# Altium project PA_CONTROL_BOARD.PrjPcb
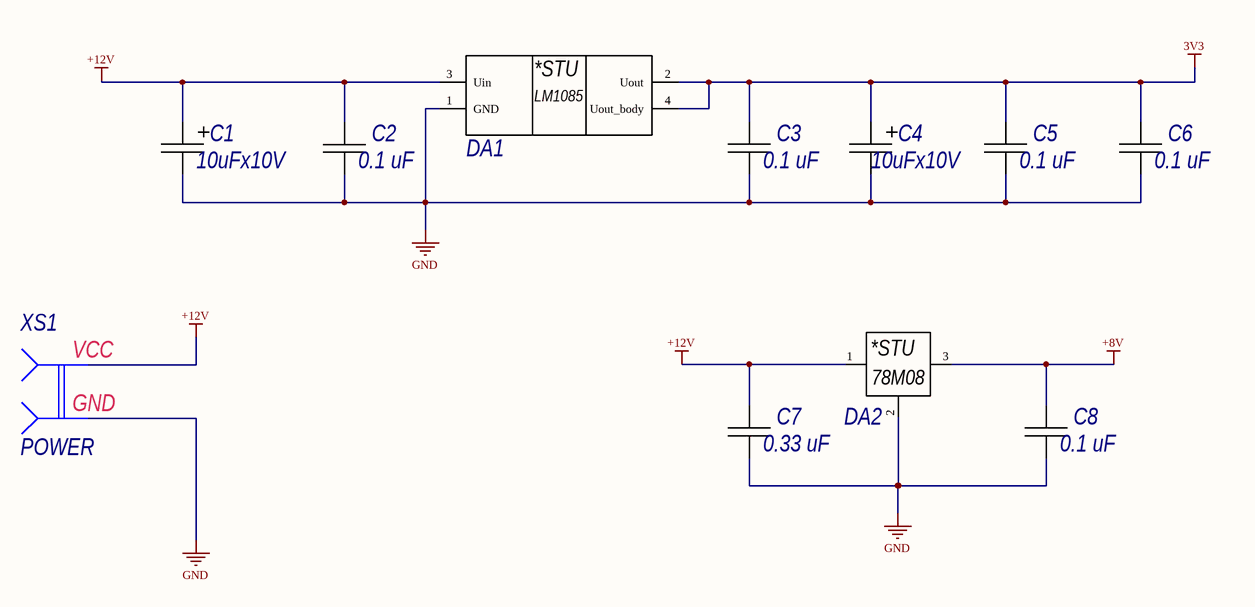
[diagram p0: POWER_SUPPLY.SchDoc]
12 sheets, 201 parts. Net scope: flat (ports and power ports of the same name join across sheets).
Board file: PA_CONTROL_BOARD.PcbDoc
Sheets:
  POWER_SUPPLY.SchDoc
  CAN.SchDoc
  FLASH.SchDoc
  DS18B20.SchDoc
  DIRECTIONAL_COUPLER.SchDoc
  FAN_CTRL.SchDoc
  JTAG_MCU.SchDoc
  SEQUENCER.SchDoc
  ETH_PHY.SchDoc
  MCU_CORE.SchDoc
  IIC_LCD.SchDoc
  EEPROM.SchDoc

## Sheet POWER_SUPPLY.SchDoc
size A4; SheetNumber: 1; SheetTotal: 3

### Parts
C1  10uFx10V
C2  0.1 uF  [C0805C]
C3  0.1 uF  [C0805C]
C4  10uFx10V
C5  0.1 uF  [C0805C]
C6  0.1 uF  [C0805C]
C7  0.33 uF  [C0805C]
C8  0.1 uF  [C0805C]
DA1  LM1085ISX-3.3  [LM1085ISX-3.3]  (value not drawn)
DA2  78M08CDT  [SC_TO-252AA]  (value not drawn)
XS1  POWER  [DG25C-B-02P-13]

### Nets
3V3: C3.2 C4.1 C5.2 C6.2 DA1.2(Uout) DA1.4(Uout_body)
+8V: C8.2 DA2.3(Out)
+12V: C1.1 C2.2 DA1.3(Uin) DA2.1(In) XS1.2
GND: C1.2 C2.1 C3.1 C4.2 C5.1 C6.1 C7.1 C8.1 DA1.1(GND) DA2.2(GND) XS1.1

Not connected (* = marked no-connect by the designer): C7 2

### Notes on the sheet
- (in symbol 78M08CDT) *STU; 78M08
- (in symbol CONNECT_PW) VCC; GND
- (in symbol LM1085ISX-3.3) *STU; LM1085

### Library data of the parts
C1 C4 = CAP_TECAP_A: Type: Конденсатор; Published: 20.08.2010; Publisher: Andrew Danich
C2 C3 C5-C8 = CAP_0805: Type: Конденсатор; Published: 18.05.2010; Publisher: Andrew Danich
XS1 = CONNECT_PW: Value: Connector; Published: 07.03.2013; Publisher: Andrew Danich; Type: Розетка
DA1 = LM1085ISX-3.3: Published: 31.07.2015; Publisher: Andrew Danich; Type: Микросхема
DA2 = 78M08CDT: Published: 13.08.2015; Publisher: Andrew Danich; Type: Микросхема

## Sheet CAN.SchDoc
size A4
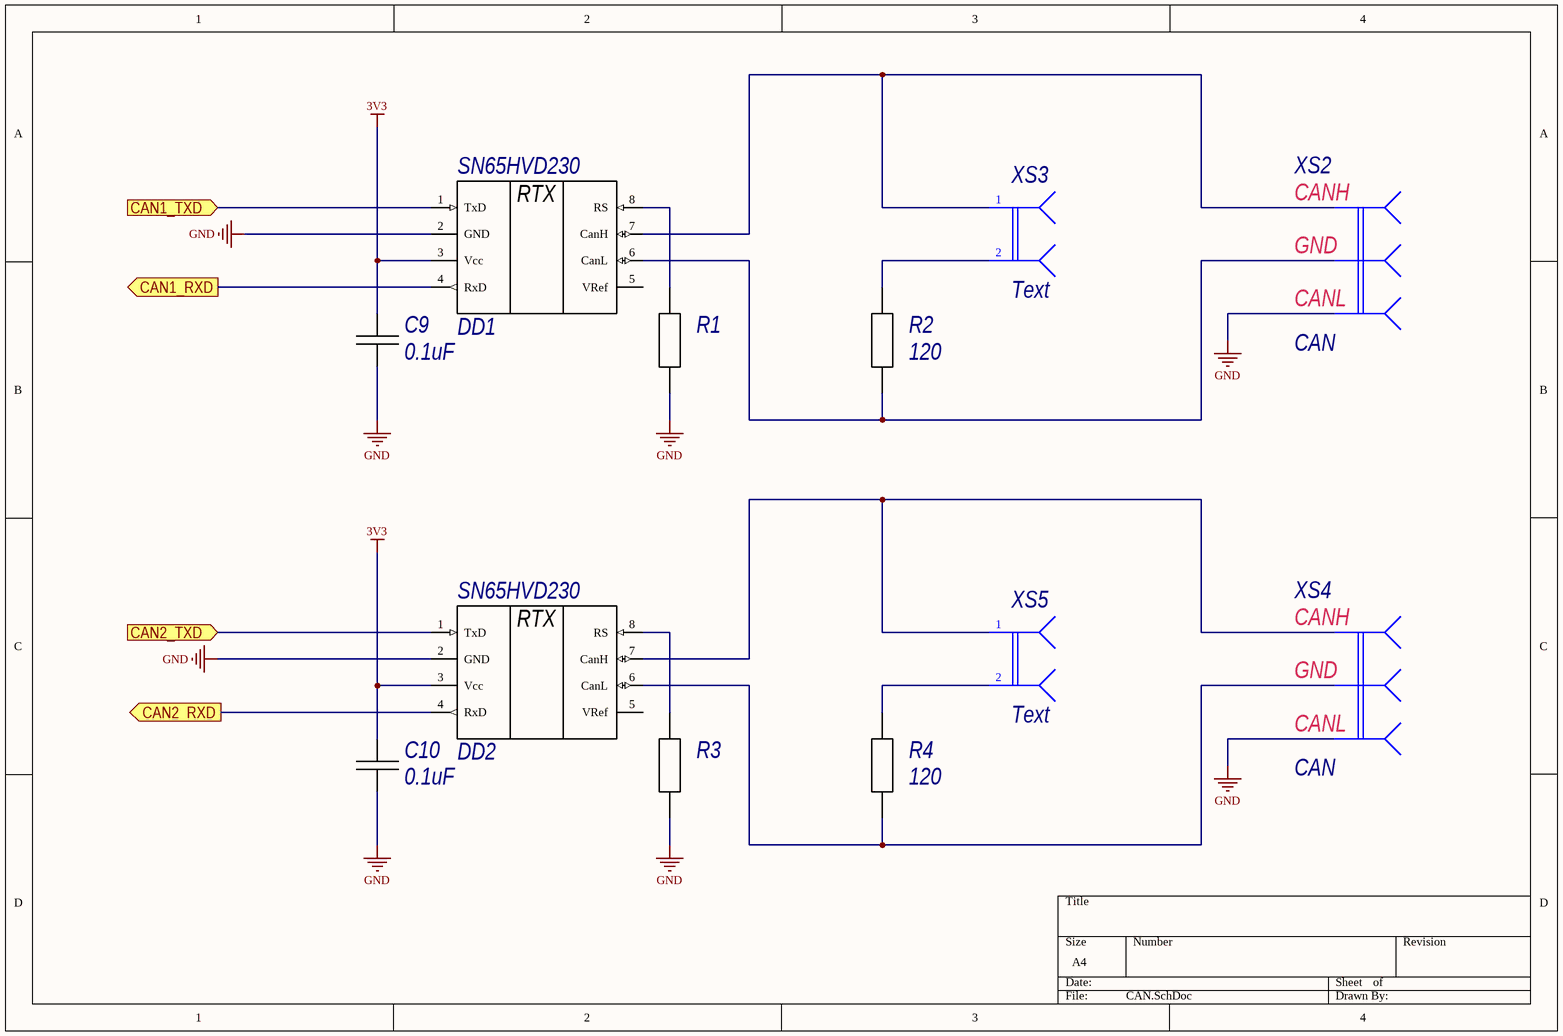
[diagram p1: CAN.SchDoc]

### Parts
(Parts that share a designator on the sheet are numbered #1, #2 ... from top to bottom, then left to right.)
C9  0.1uF  [C0805C]
C10#1  0.1uF  [C0805C]
DD1  SN65HVD230  [SOIC8 (SO-8)]
DD2#1  SN65HVD230  [SOIC8 (SO-8)]
R1  R0805  [C0805R]  (value not drawn)
R2  120  [C0805R]
R3#1  R0805  [C0805R]  (value not drawn)
R4#1  120  [C0805R]
XS2  CAN  [YX-XH-3]
XS3  Text  [PLD2]
XS4  CAN  [YX-XH-3]
XS5  Text  [PLD2]

### Ports
CAN1_RXD (out), CAN1_TXD (in), CAN2_RXD (out), CAN2_TXD (in)

### Nets
3V3: C9.2 C10#1.2 DD1.3(Vcc) DD2#1.3(Vcc)
GND: C9.1 C10#1.1 DD1.2(GND) DD2#1.2(GND) R1.2 R3#1.2 XS2.3 XS4.3
CAN1_RXD: DD1.4(RxD) ; port CAN1_RXD
CAN1_TXD: DD1.1(TxD) ; port CAN1_TXD
NetDD1_6: DD1.6(CanL) R2.2 XS2.2
NetDD1_7: DD1.7(CanH) XS2.1 XS3.1
NetDD1_8: DD1.8(RS) R1.1
NetDD2#1_1: DD2#1.1(TxD) ; port CAN2_TXD
NetDD2#1_4: DD2#1.4(RxD) ; port CAN2_RXD
NetDD2#1_6: DD2#1.6(CanL) R4#1.2 XS4.2
NetDD2#1_7: DD2#1.7(CanH) XS4.1 XS5.1
NetDD2#1_8: DD2#1.8(RS) R3#1.1
NetR2_1: R2.1 XS3.2
NetR4#1_1: R4#1.1 XS5.2

Not connected (* = marked no-connect by the designer): DD1 5(VRef); DD2#1 5(VRef)

### Notes on the sheet
- (in symbol CONNECT_CAN) CANH; GND; CANL
- (in symbol SN65HVD230) RTX

### Library data of the parts
C9 C10#1 = CAP_0805: Type: Конденсатор; Published: 18.05.2010; Publisher: Andrew Danich
DD1 DD2#1 = SN65HVD230: Высокоскоростной CAN-Трансивер, 1Мб/с, 12В/24В, до 112 узлов; Published: 26.02.2013; Publisher: Andrew Danich; Type: Микросхема
R2 R4#1 = R0805: Published: 24.03.2010; Publisher: Andrew Danich; Type: Резистор
XS2 XS4 = CONNECT_CAN: Published: 07.03.2013; Publisher: Andrew Danich; Type: Розетка
XS3 XS5 = DS1021: Value: Connector; Published: 07.03.2013; Publisher: Andrew Danich; Type: Розетка
R1 R3#1 = R0805: Published: 24.03.2010; Publisher: Andrew Danich; Type: Резистор

## Sheet FLASH.SchDoc
size A4
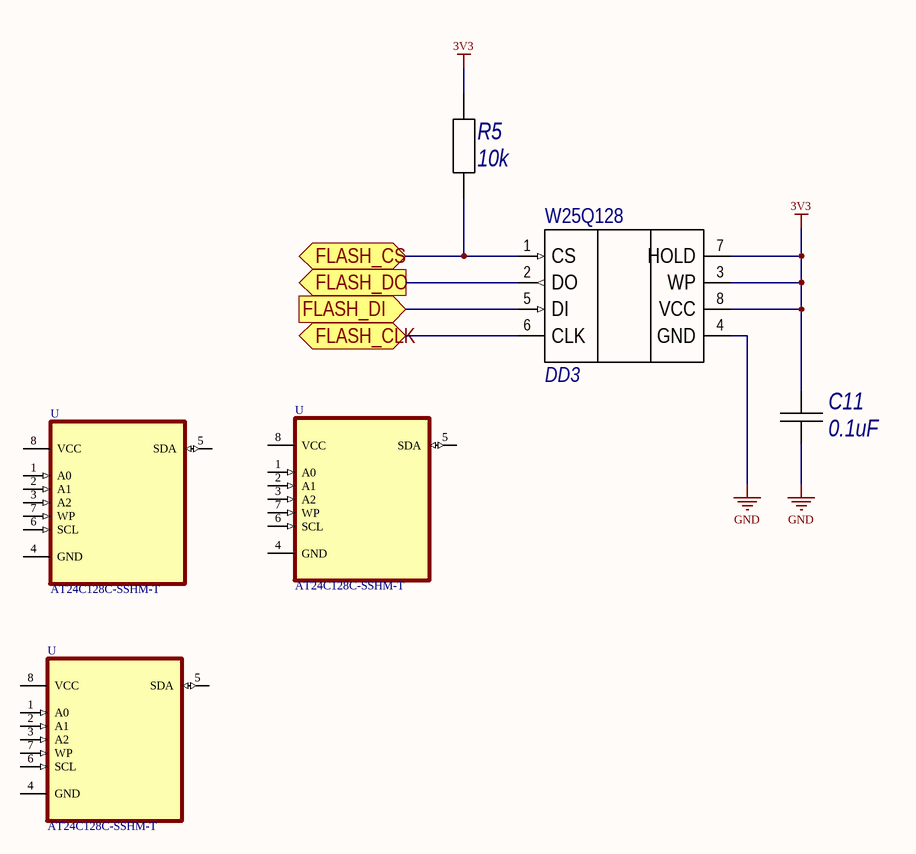
[diagram p2: FLASH.SchDoc]

### Parts
(Parts that share a designator on the sheet are numbered #1, #2 ... from top to bottom, then left to right.)
C11  0.1uF  [C0805C]
DD3  W25Q128  [SOIC8 (SO-8)]
R5  10k  [C0805R]
U#1  AT24C128C-SSHM-T  [SOIC127P600X175-8N]
U#2  AT24C128C-SSHM-T  [SOIC127P600X175-8N]
U#3  AT24C128C-SSHM-T  [SOIC127P600X175-8N]

### Ports
FLASH_CLK (bidir), FLASH_CS (bidir), FLASH_DI (in), FLASH_DO (out)

### Nets
3V3: C11.2 DD3.3(WP) DD3.7(HOLD) DD3.8(VCC) R5.2
GND: C11.1 DD3.4(GND)
NetDD3_1: DD3.1(CS) R5.1 ; port FLASH_CS
NetDD3_2: DD3.2(DO) ; port FLASH_DO
NetDD3_5: DD3.5(DI) ; port FLASH_DI
NetDD3_6: DD3.6(CLK) ; port FLASH_CLK

Not connected (* = marked no-connect by the designer): U#1 1(A0) 2(A1) 3(A2) 4(GND) 5(SDA) 6(SCL) 7(WP) 8(VCC); U#2 1(A0) 2(A1) 3(A2) 4(GND) 5(SDA) 6(SCL) 7(WP) 8(VCC); U#3 1(A0) 2(A1) 3(A2) 4(GND) 5(SDA) 6(SCL) 7(WP) 8(VCC)

### Library data of the parts
C11 = CAP_0805: Type: Конденсатор; Published: 18.05.2010; Publisher: Andrew Danich
R5 = RES_0805: Published: 24.03.2010; Publisher: Andrew Danich; Type: Резистор
U#1-U#3 = AT24C128C-SSHM-T: EEPROM Memory IC 128Kb _16K x 8_ IÂ²C 1MHz 550ns 8-SOIC; MF: Microchip; MP: AT24C128C-SSHM-T; SnapEDA_Link: https://www.snapeda.com/parts/AT24C128C-SSHM-T/Microchip/view-part/1771999/?ref=snap; Value: *; Package: SO-8 Microchip; Price: None; Availability: Unavailable
DD3 = W25Q128: Value: *

## Sheet DS18B20.SchDoc
size A4
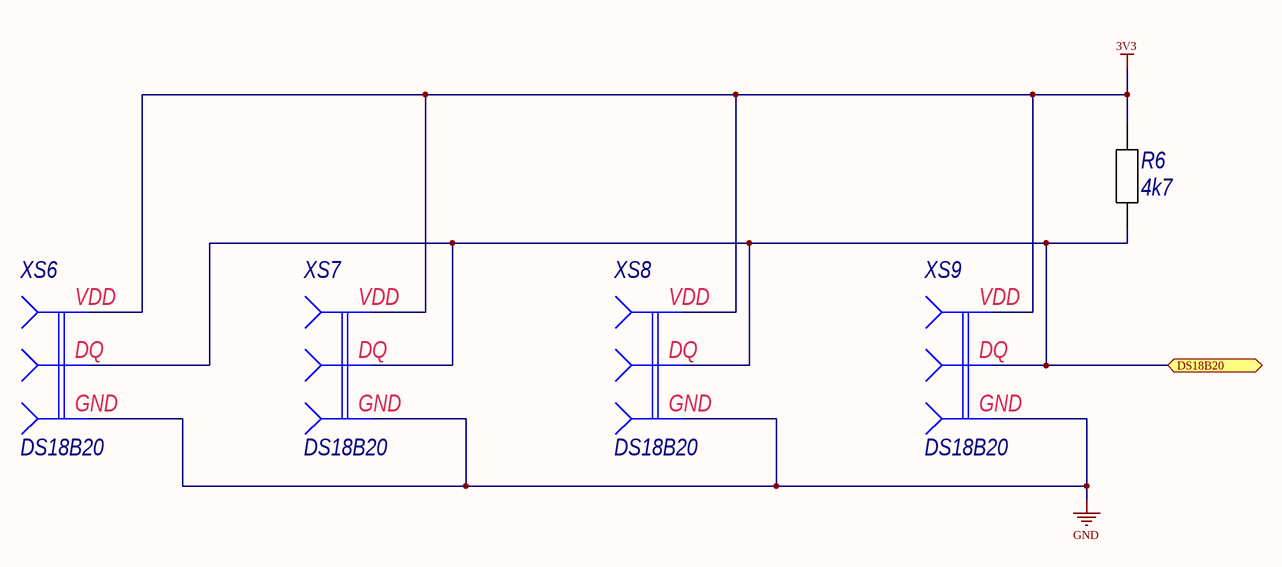
[diagram p3: DS18B20.SchDoc]

### Parts
R6  4k7  [C0805R]
XS6  DS18B20  [YX-XH-3]
XS7  DS18B20  [YX-XH-3]
XS8  DS18B20  [YX-XH-3]
XS9  DS18B20  [YX-XH-3]

### Ports
DS18B20 (bidir)

### Nets
3V3: R6.1 XS6.1 XS7.1 XS8.1 XS9.1
GND: XS6.3 XS7.3 XS8.3 XS9.3
NetR6_2: R6.2 XS6.2 XS7.2 XS8.2 XS9.2 ; port DS18B20

### Notes on the sheet
- (in symbol DS18B20) VDD; DQ; GND

### Library data of the parts
R6 = R0805: Published: 24.03.2010; Publisher: Andrew Danich; Type: Резистор
XS6-XS9 = DS18B20: Published: 07.03.2013; Publisher: Andrew Danich; Type: Розетка

## Sheet DIRECTIONAL_COUPLER.SchDoc
size A4
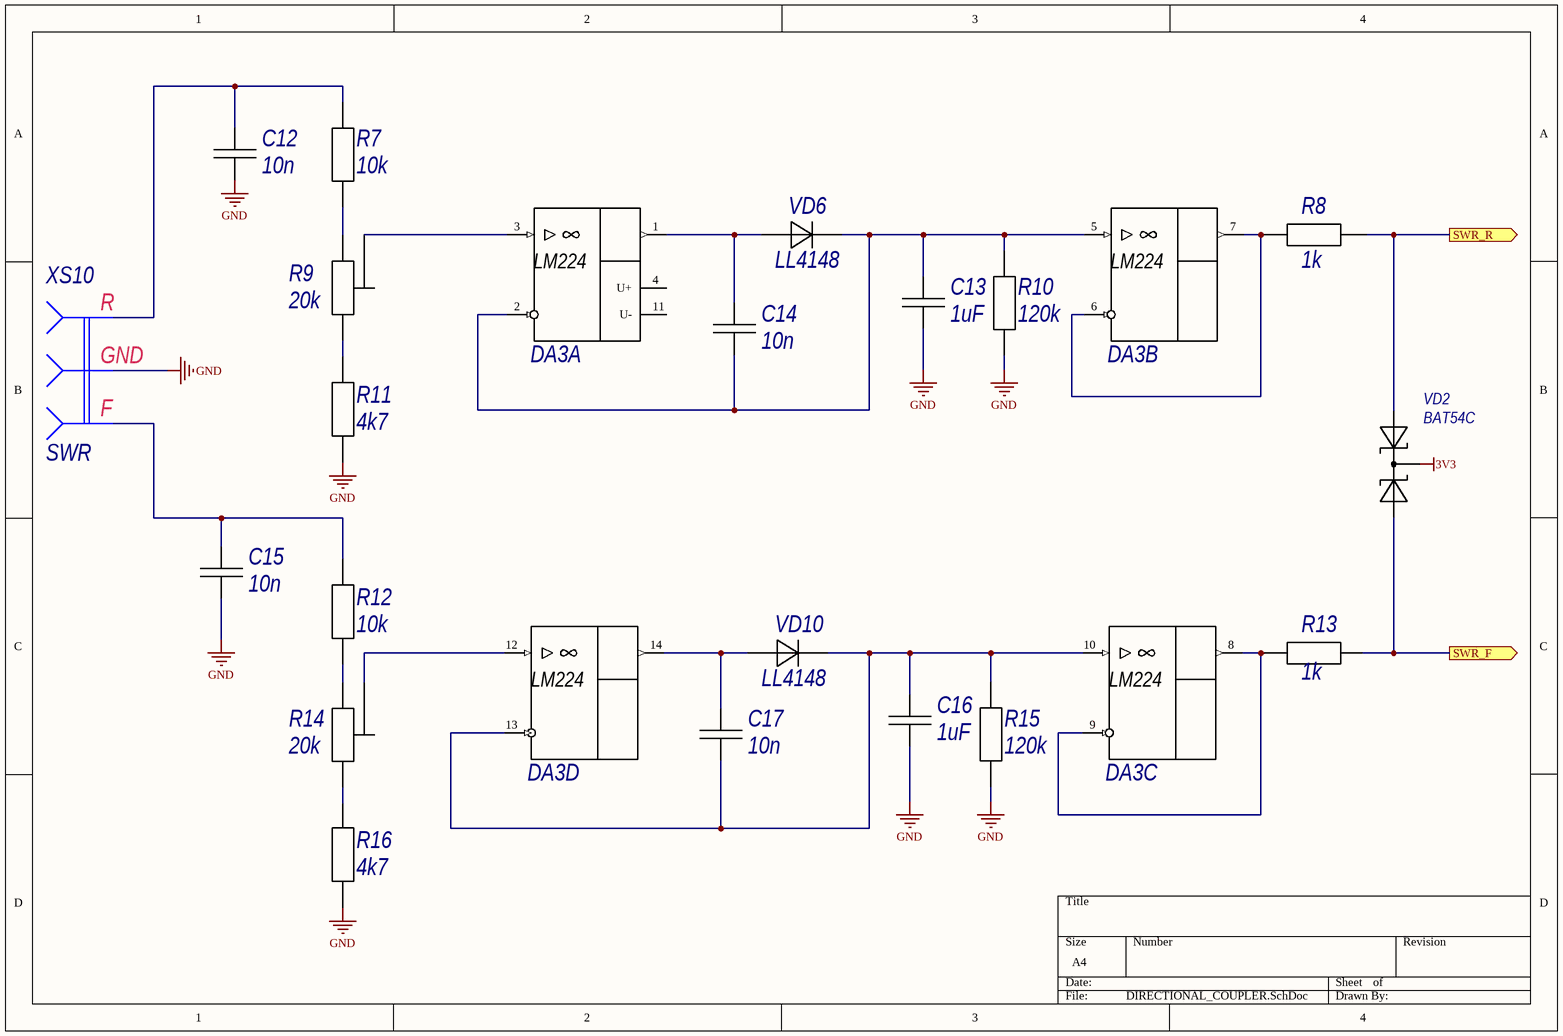
[diagram p4: DIRECTIONAL_COUPLER.SchDoc]

### Parts
C12  10n  [C0805C]
C13  1uF  [C0805C]
C14  10n  [C0805C]
C15  10n  [C0805C]
C16  1uF  [C0805C]
C17  10n  [C0805C]
DA3  LM224  [Texas_Instruments_D0014A_IPC_A]  (value not drawn)  (parts A,B,C,D of 4)
R7  10k  [C0805R]
R8  1k  [C0805R]
R9  20k  [TRIM_3296W-1-254LF]
R10  120k  [C0805R]
R11  4k7  [C0805R]
R12  10k  [C0805R]
R13  1k  [C0805R]
R14  20k  [TRIM_3296W-1-254LF]
R15  120k  [C0805R]
R16  4k7  [C0805R]
VD2  BAT54C  [BAT54C_SOT23-3]
VD6  LL4148  [DIO_LL4148]
VD10  LL4148  [DIO_LL4148]
XS10  SWR

### Ports
SWR_F (out), SWR_R (out)

### Nets
3V3: VD2.3(AC)
GND: C12.1 C13.1 C15.1 C16.1 R10.2 R11.1 R15.1 R16.1 XS10.2
NetC12_2: C12.2 R7.2 XS10.1
NetC13_2: C13.2 C14.1 DA3.2(IN-) DA3.5(IN+) R10.1 VD6.2(К)
NetC14_2: C14.2 DA3.1(OUT) VD6.1(А)
NetC15_2: C15.2 R12.2 XS10.3
NetC16_2: C16.2 C17.1 DA3.10(IN+) DA3.13(IN-) R15.2 VD10.2(К)
NetC17_2: C17.2 DA3.14(OUT) VD10.1(А)
NetDA3_3: DA3.3(IN+) R9.2
NetDA3_6: DA3.6(IN-) DA3.7(OUT) R8.2
NetDA3_8: DA3.8(OUT) DA3.9(IN-) R13.2
NetDA3_12: DA3.12(IN+) R14.2
NetDD5_23: R8.1 VD2.1(А1) ; port SWR_R
NetDD5_26: R13.1 VD2.2(C) ; port SWR_F
NetR7_1: R7.1 R9.1
NetR9_3: R9.3 R11.2
NetR12_1: R12.1 R14.1
NetR14_3: R14.3 R16.2

Not connected (* = marked no-connect by the designer): DA3 4(U+) 11(U-)

### Notes on the sheet
- (in symbol DIR_COUP) R; GND; F

### Library data of the parts
C12-C17 = CAP_0805: Type: Конденсатор; Published: 18.05.2010; Publisher: Andrew Danich
R7 R8 R10-R13 R15 R16 = RES_0805: Published: 24.03.2010; Publisher: Andrew Danich; Type: Резистор
R9 R14 = Resistor-Trimmer-1: Publisher: Andrew Danich; Type: Подстроечный резистор; Published: 27.07.2015
VD2 = BAT54C: Small Signal Schottky Diode, Dual Common Cathode, 30 V, 200 mA, 400 mV, 600 mA, 125 C
VD6 VD10 = LL4148: Type: Диод; Published: 18.05.2010; Publisher: Andrew Danich
XS10 = DIR_COUP: Published: 07.03.2013; Publisher: Andrew Danich; Type: Розетка
DA3 = LM224: Published: 29.07.2015; Publisher: Andrew Danich; Type: Микросхема

## Sheet FAN_CTRL.SchDoc
size A4
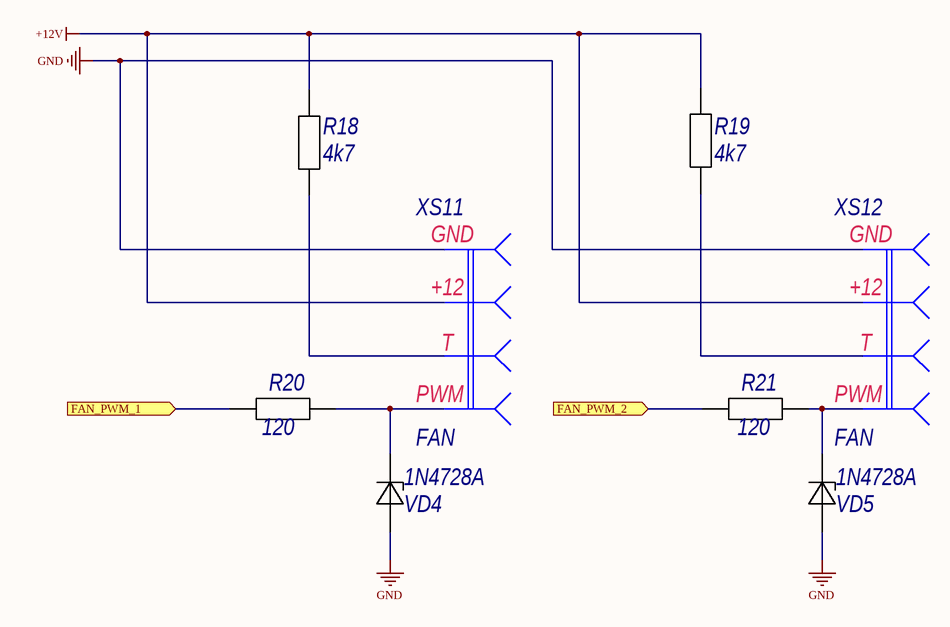
[diagram p5: FAN_CTRL.SchDoc]

### Parts
R18  4k7  [C0805R]
R19  4k7  [C0805R]
R20  120  [C0805R]
R21  120  [C0805R]
VD4  1N4728A  [DO-41]
VD5  1N4728A  [DO-41]
XS11  FAN  [PLD1X4]
XS12  FAN  [PLD1X4]

### Ports
FAN_PWM_1 (in), FAN_PWM_2 (in)

### Nets
+12V: R18.2 R19.2 XS11.2 XS12.2
GND: VD4.1(А) VD5.1(А) XS11.1 XS12.1
NetR18_1: R18.1 XS11.3
NetR19_1: R19.1 XS12.3
NetR20_1: R20.1 ; port FAN_PWM_1
NetR20_2: R20.2 VD4.2(К) XS11.4
NetR21_1: R21.1 ; port FAN_PWM_2
NetR21_2: R21.2 VD5.2(К) XS12.4

### Notes on the sheet
- (in symbol FAN_CON) GND; +12; T; PWM

### Library data of the parts
R18-R21 = RES_0805: Published: 24.03.2010; Publisher: Andrew Danich; Type: Резистор
VD4 VD5 = 1N4728A: Type: Стабилитрон; Published: 20.05.2013; Publisher: Andrew Danich
XS11 XS12 = FAN_CON: Value: Connector; Published: 07.03.2013; Publisher: Andrew Danich; Type: Розетка

## Sheet JTAG_MCU.SchDoc
size A3
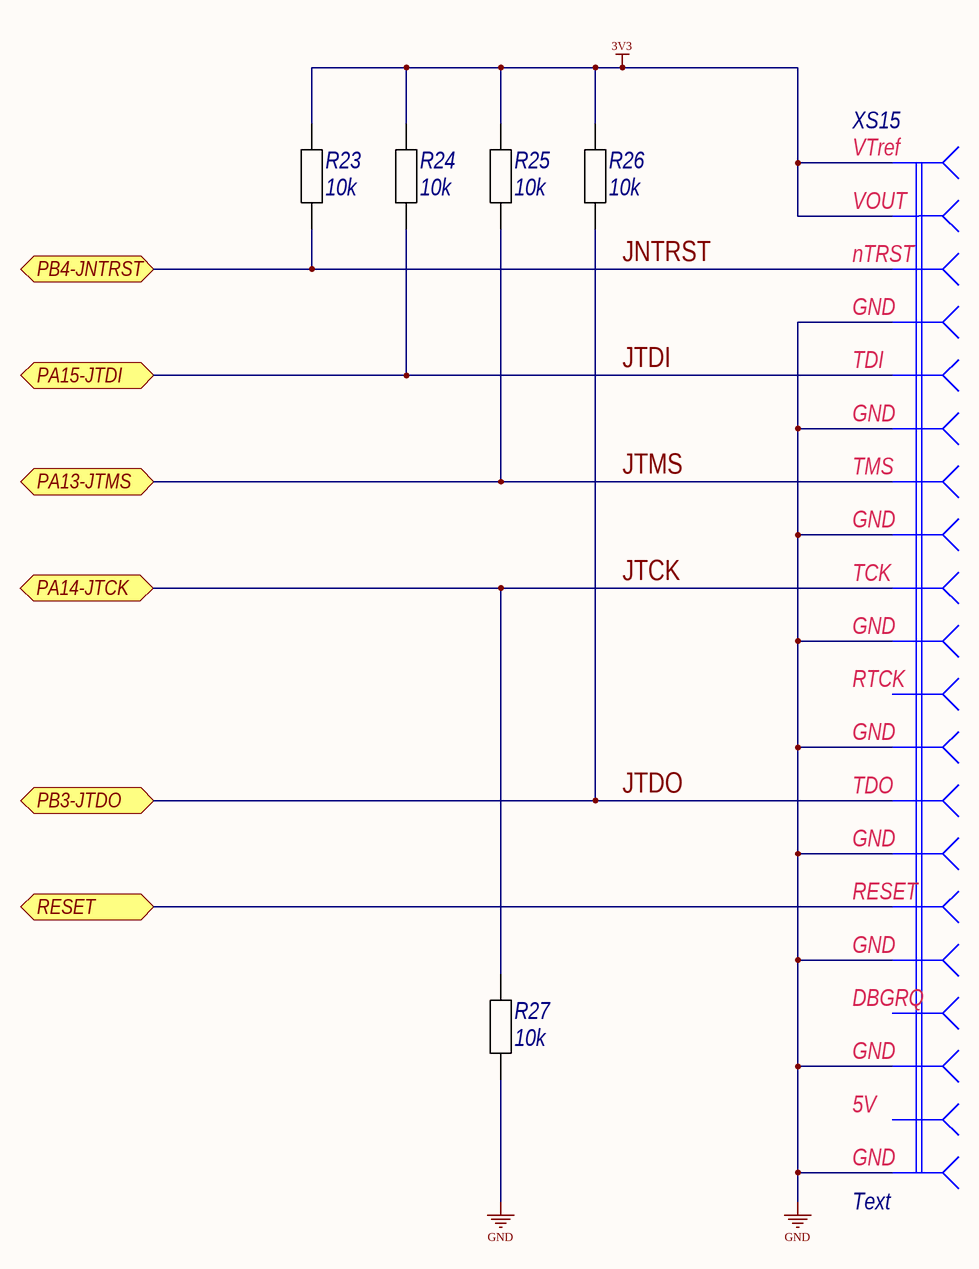
[diagram p6: JTAG_MCU.SchDoc]

### Parts
R23  10k  [C0805R]
R24  10k  [C0805R]
R25  10k  [C0805R]
R26  10k  [C0805R]
R27  10k  [C0805R]
XS15  Text  [IDC-20]

### Ports
PA13-JTMS (bidir), PA14-JTCK (bidir), PA15-JTDI (bidir), PB3-JTDO (bidir), PB4-JNTRST (bidir), RESET (bidir)

### Nets
3V3: R23.2 R24.2 R25.2 R26.2 XS15.1 XS15.2
GND: R27.1 XS15.4 XS15.6 XS15.8 XS15.10 XS15.12 XS15.14 XS15.16 XS15.18 XS15.20
JNTRST: R23.1 XS15.3 ; port PB4-JNTRST
JTCK: R27.2 XS15.9 ; port PA14-JTCK
JTDI: R24.1 XS15.5 ; port PA15-JTDI
JTDO: R26.1 XS15.13 ; port PB3-JTDO
JTMS: R25.1 XS15.7 ; port PA13-JTMS
NRST: XS15.15 ; port RESET

Not connected (* = marked no-connect by the designer): XS15 11 17 19

### Notes on the sheet
- (in symbol JTAG) VTref; VOUT; nTRST; GND; TDI; TMS; TCK; RTCK; TDO; RESET; DBGRQ; 5V

### Library data of the parts
R23-R27 = R0805: Published: 24.03.2010; Publisher: Andrew Danich; Type: Резистор
XS15 = JTAG: Value: Connector; Published: 07.03.2013; Publisher: Andrew Danich; Type: Розетка

## Sheet SEQUENCER.SchDoc
size A3
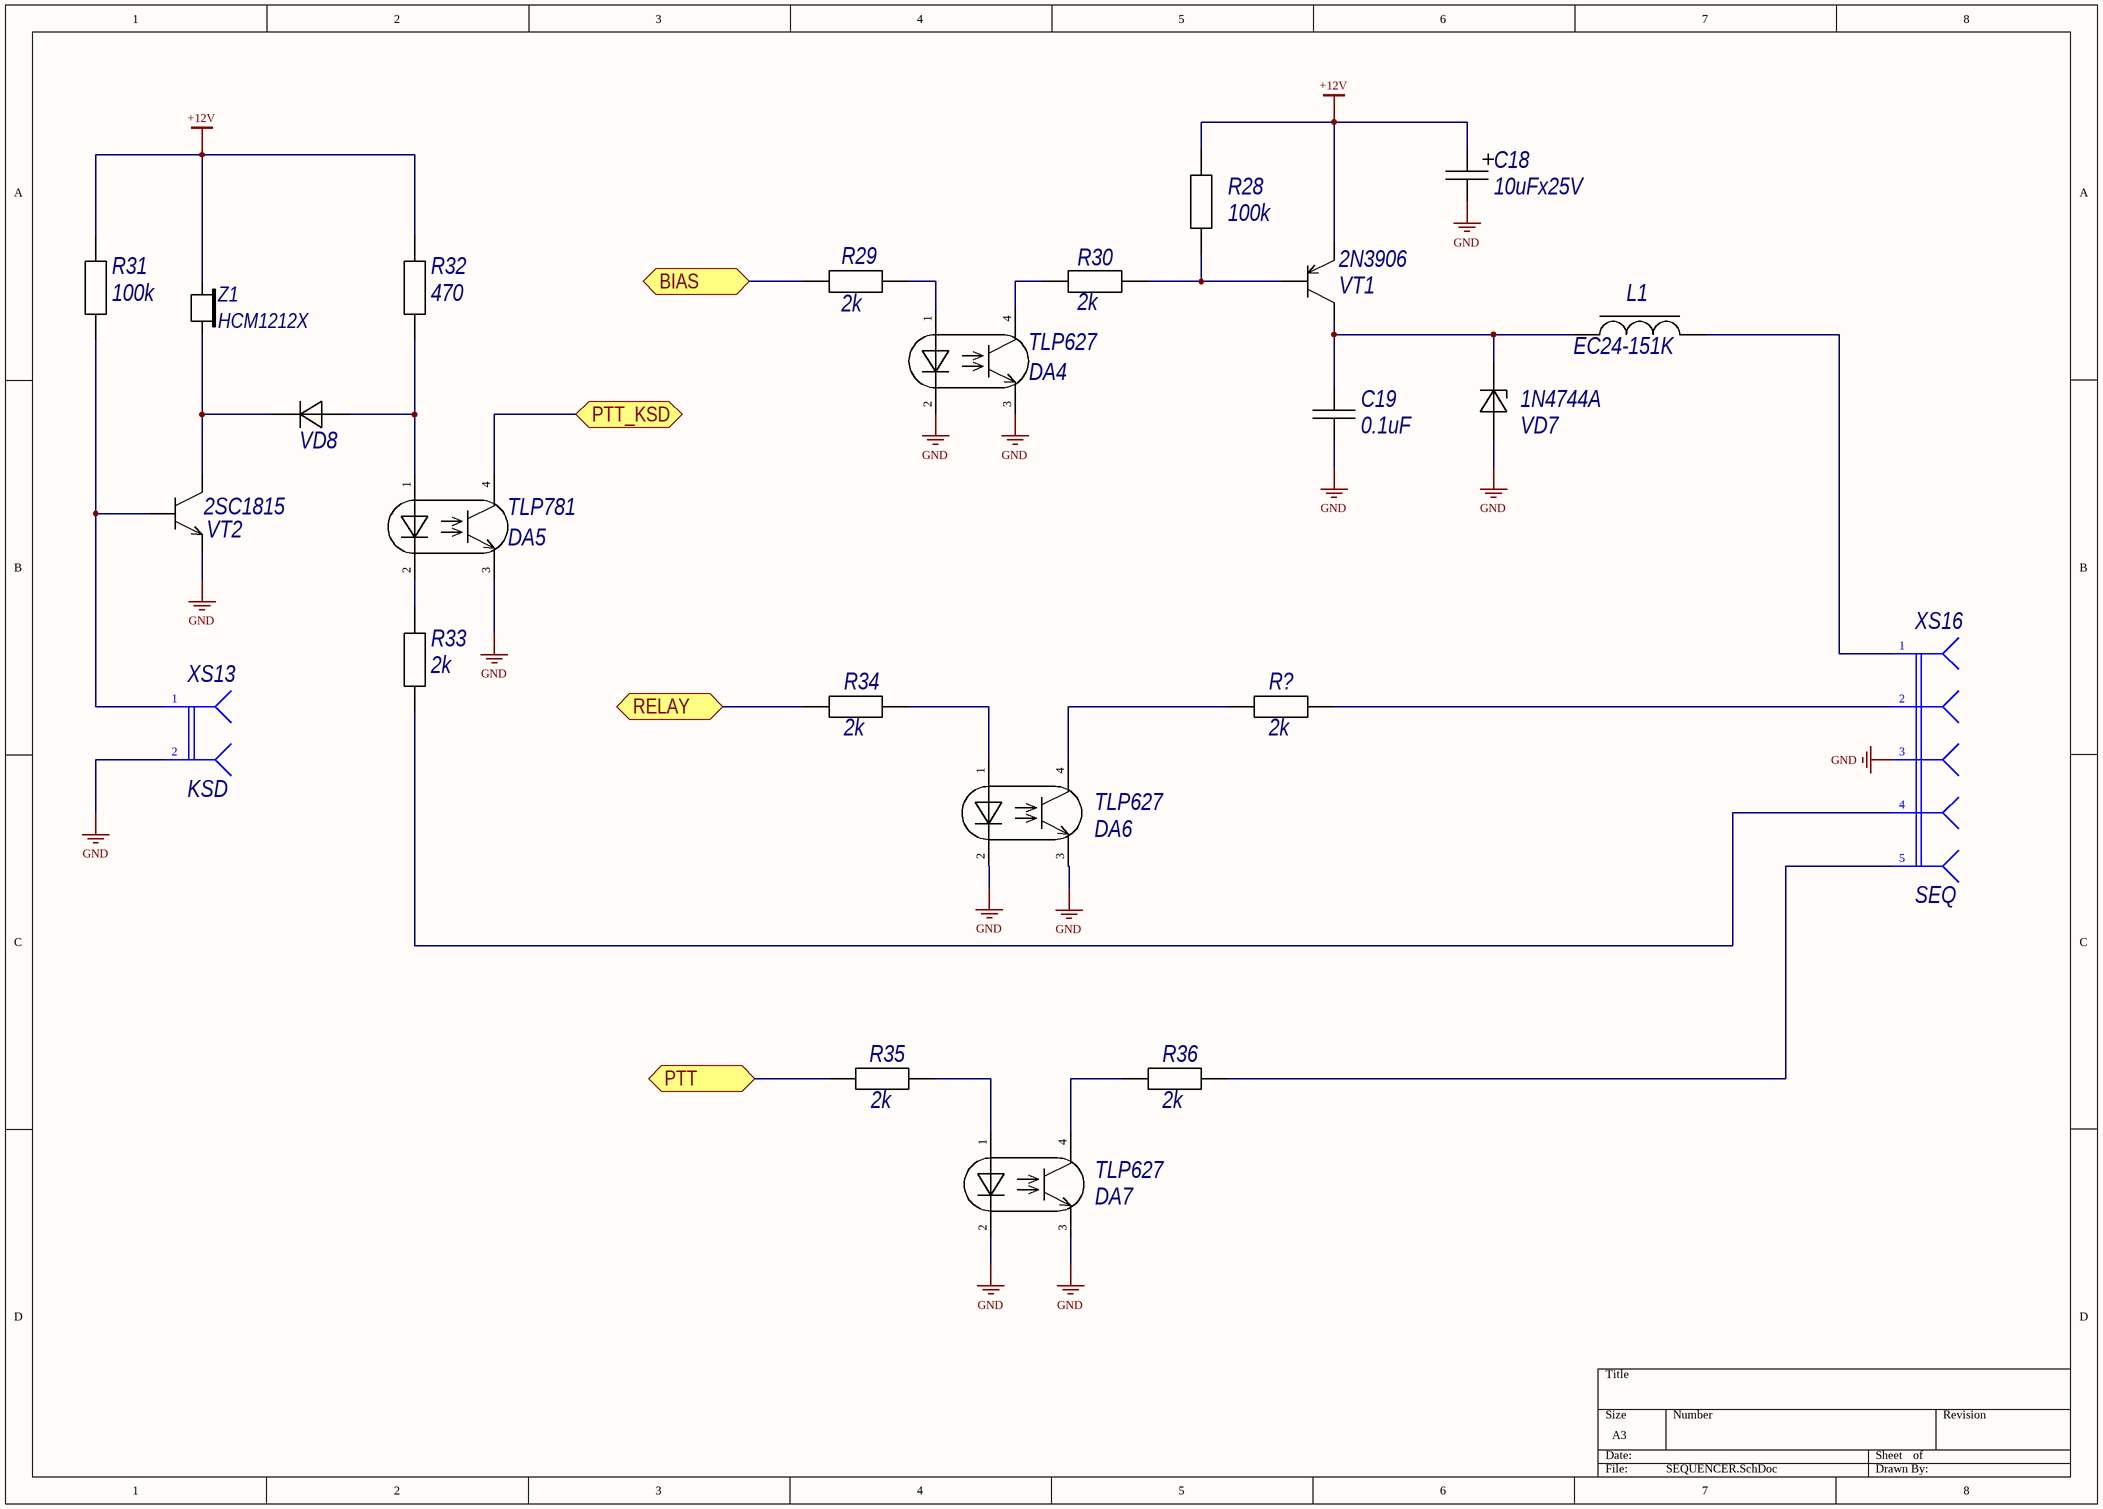
[diagram p7: SEQUENCER.SchDoc]

### Parts
(Parts that share a designator on the sheet are numbered #1, #2 ... from top to bottom, then left to right.)
C18  10uFx25V  [TECAP_A]
C19  0.1uF  [C0805C]
DA4  TLP627  [DIP-4]
DA5  TLP781  [DIP-4]
DA6  TLP627  [DIP-4]
DA7  TLP627  [DIP-4]
L1  EC24-151K  [AXIAL-0.6]
R28  100k  [AXIAL-0.6]
R29  2k  [AXIAL-0.6]
R30  2k  [AXIAL-0.6]
R31  100k  [AXIAL-0.6]
R32  470  [AXIAL-0.6]
R33  2k  [AXIAL-0.6]
R34  2k  [AXIAL-0.6]
R35  2k  [AXIAL-0.6]
R36  2k  [AXIAL-0.6]
R?#1  2k  [AXIAL-0.6]
VD7  1N4744A  [DO-41]
VD8  1N4007  [DO-41]  (value not drawn)
VT1  2N3906  [TO-92-A]
VT2  2SC1815  [TO-92-A]
XS13  KSD  [WF-2]
XS16  SEQ  [WF-5]
Z1  HCM1212X  [HCM1206X]

### Ports
BIAS (bidir), PTT (bidir), PTT_KSD (bidir), RELAY (bidir)

### Nets
+12V: C18.1 R28.1 R31.2 R32.2 VT1.3(Э) Z1.2
GND: C18.2 C19.2 DA4.2(CК) DA4.3(Э) DA5.3(Э) DA6.2(CК) DA6.3(Э) DA7.2(CК) DA7.3(Э) VD7.1(А) VT2.3(Э) XS13.2 XS16.3
NetC19_1: C19.1 L1.1 VD7.2(К) VT1.2(К)
NetDA4_1: DA4.1(CА) R29.1
NetDA4_4: DA4.4(К) R30.2
NetDA5_1: DA5.1(CА) R32.1 VD8.2
NetDA5_2: DA5.2(CК) R33.2
NetDA5_4: DA5.4(К) ; port PTT_KSD
NetDA6_1: DA6.1(CА) R34.1
NetDA6_4: DA6.4(К) R?#1.2
NetDA7_1: DA7.1(CА) R35.1
NetDA7_4: DA7.4(К) R36.2
NetL1_2: L1.2 XS16.1
NetR28_2: R28.2 R30.1 VT1.1(Б)
NetR29_2: R29.2 ; port BIAS
NetR31_1: R31.1 VT2.1(Б) XS13.1
NetR33_1: R33.1 XS16.4
NetR34_2: R34.2 ; port RELAY
NetR35_2: R35.2 ; port PTT
NetR36_1: R36.1 XS16.5
NetR?#1_1: R?#1.1 XS16.2
NetVD8_1: VD8.1 VT2.2(К) Z1.1

### Library data of the parts
C18 = CAP_TECAP_A: Type: Конденсатор; Published: 20.08.2010; Publisher: Andrew Danich
C19 = CAP_0805: Type: Конденсатор; Published: 18.05.2010; Publisher: Andrew Danich
L1 = IND_BIAS: Type: Дроссель; Published: 20.05.2010; Publisher: Andrew Danich
R28-R36 R?#1 = RES_1W: Published: 24.03.2010; Publisher: Andrew Danich; Type: Резистор
VD7 = 1N4744A: Type: Стабилитрон; Published: 20.05.2013; Publisher: Andrew Danich
VD8 = 1N4007: Type: Диод; Published: 18.05.2010; Publisher: Andrew Danich
VT1 = 2N3906: Type: Транзистор; Published: 07.05.2013; Publisher: Andrew Danich
VT2 = 2SC1815: Type: Транзистор; Published: 07.05.2013; Publisher: Andrew Danich
XS13 = CONNECT_KSD: Value: Connector; Published: 07.03.2013; Publisher: Andrew Danich; Type: Розетка
XS16 = CONNECT_SEQ: Value: Connector; Published: 07.03.2013; Publisher: Andrew Danich; Type: Розетка
DA4 DA6 DA7 = TLP627: Published: 09.01.2017; Publisher: Andrew Danich; Type: Микросхема
DA5 = TLP781: Published: 09.01.2017; Publisher: Andrew Danich; Type: Микросхема

## Sheet ETH_PHY.SchDoc
size A2
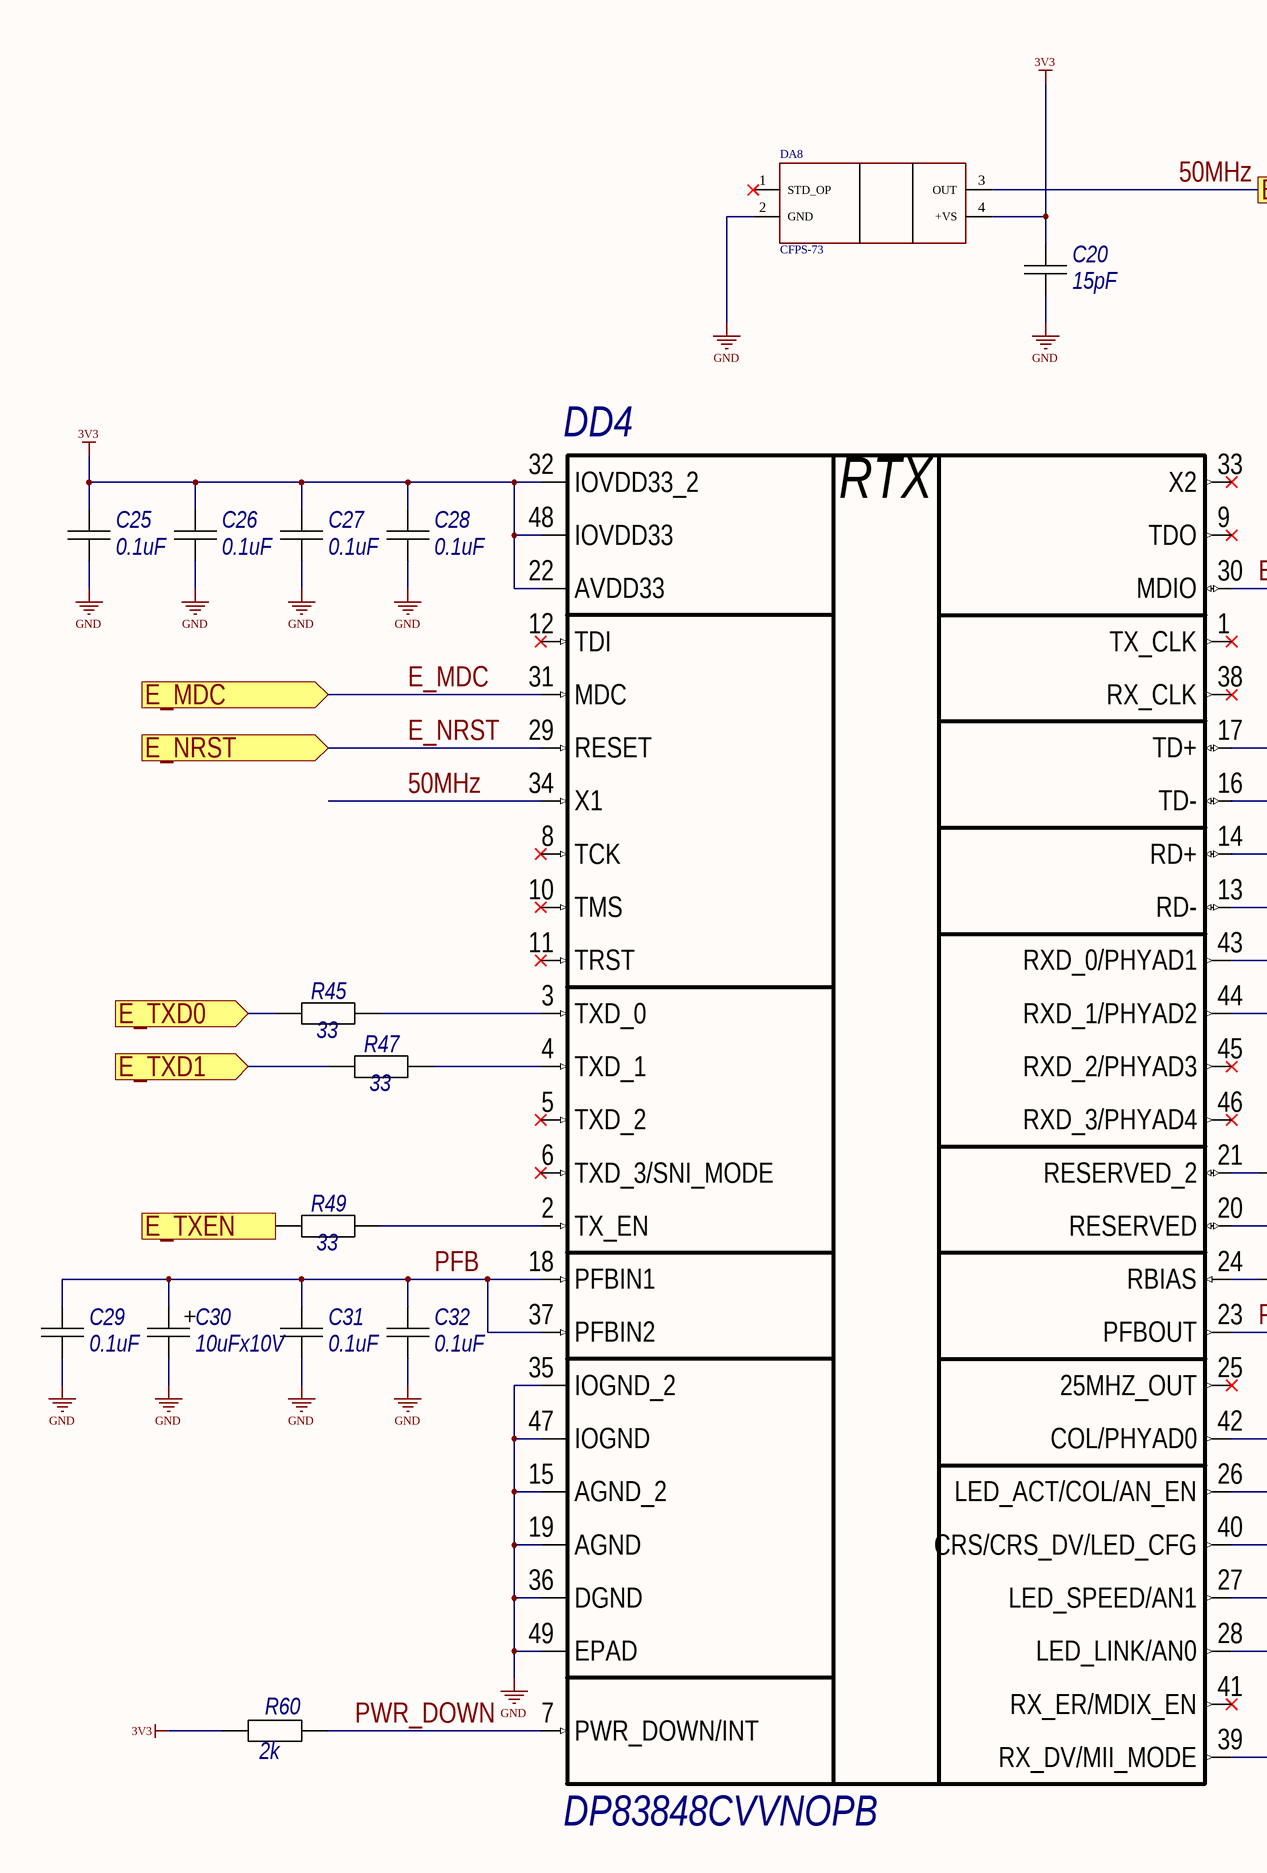
[diagram p8: ETH_PHY.SchDoc, left]
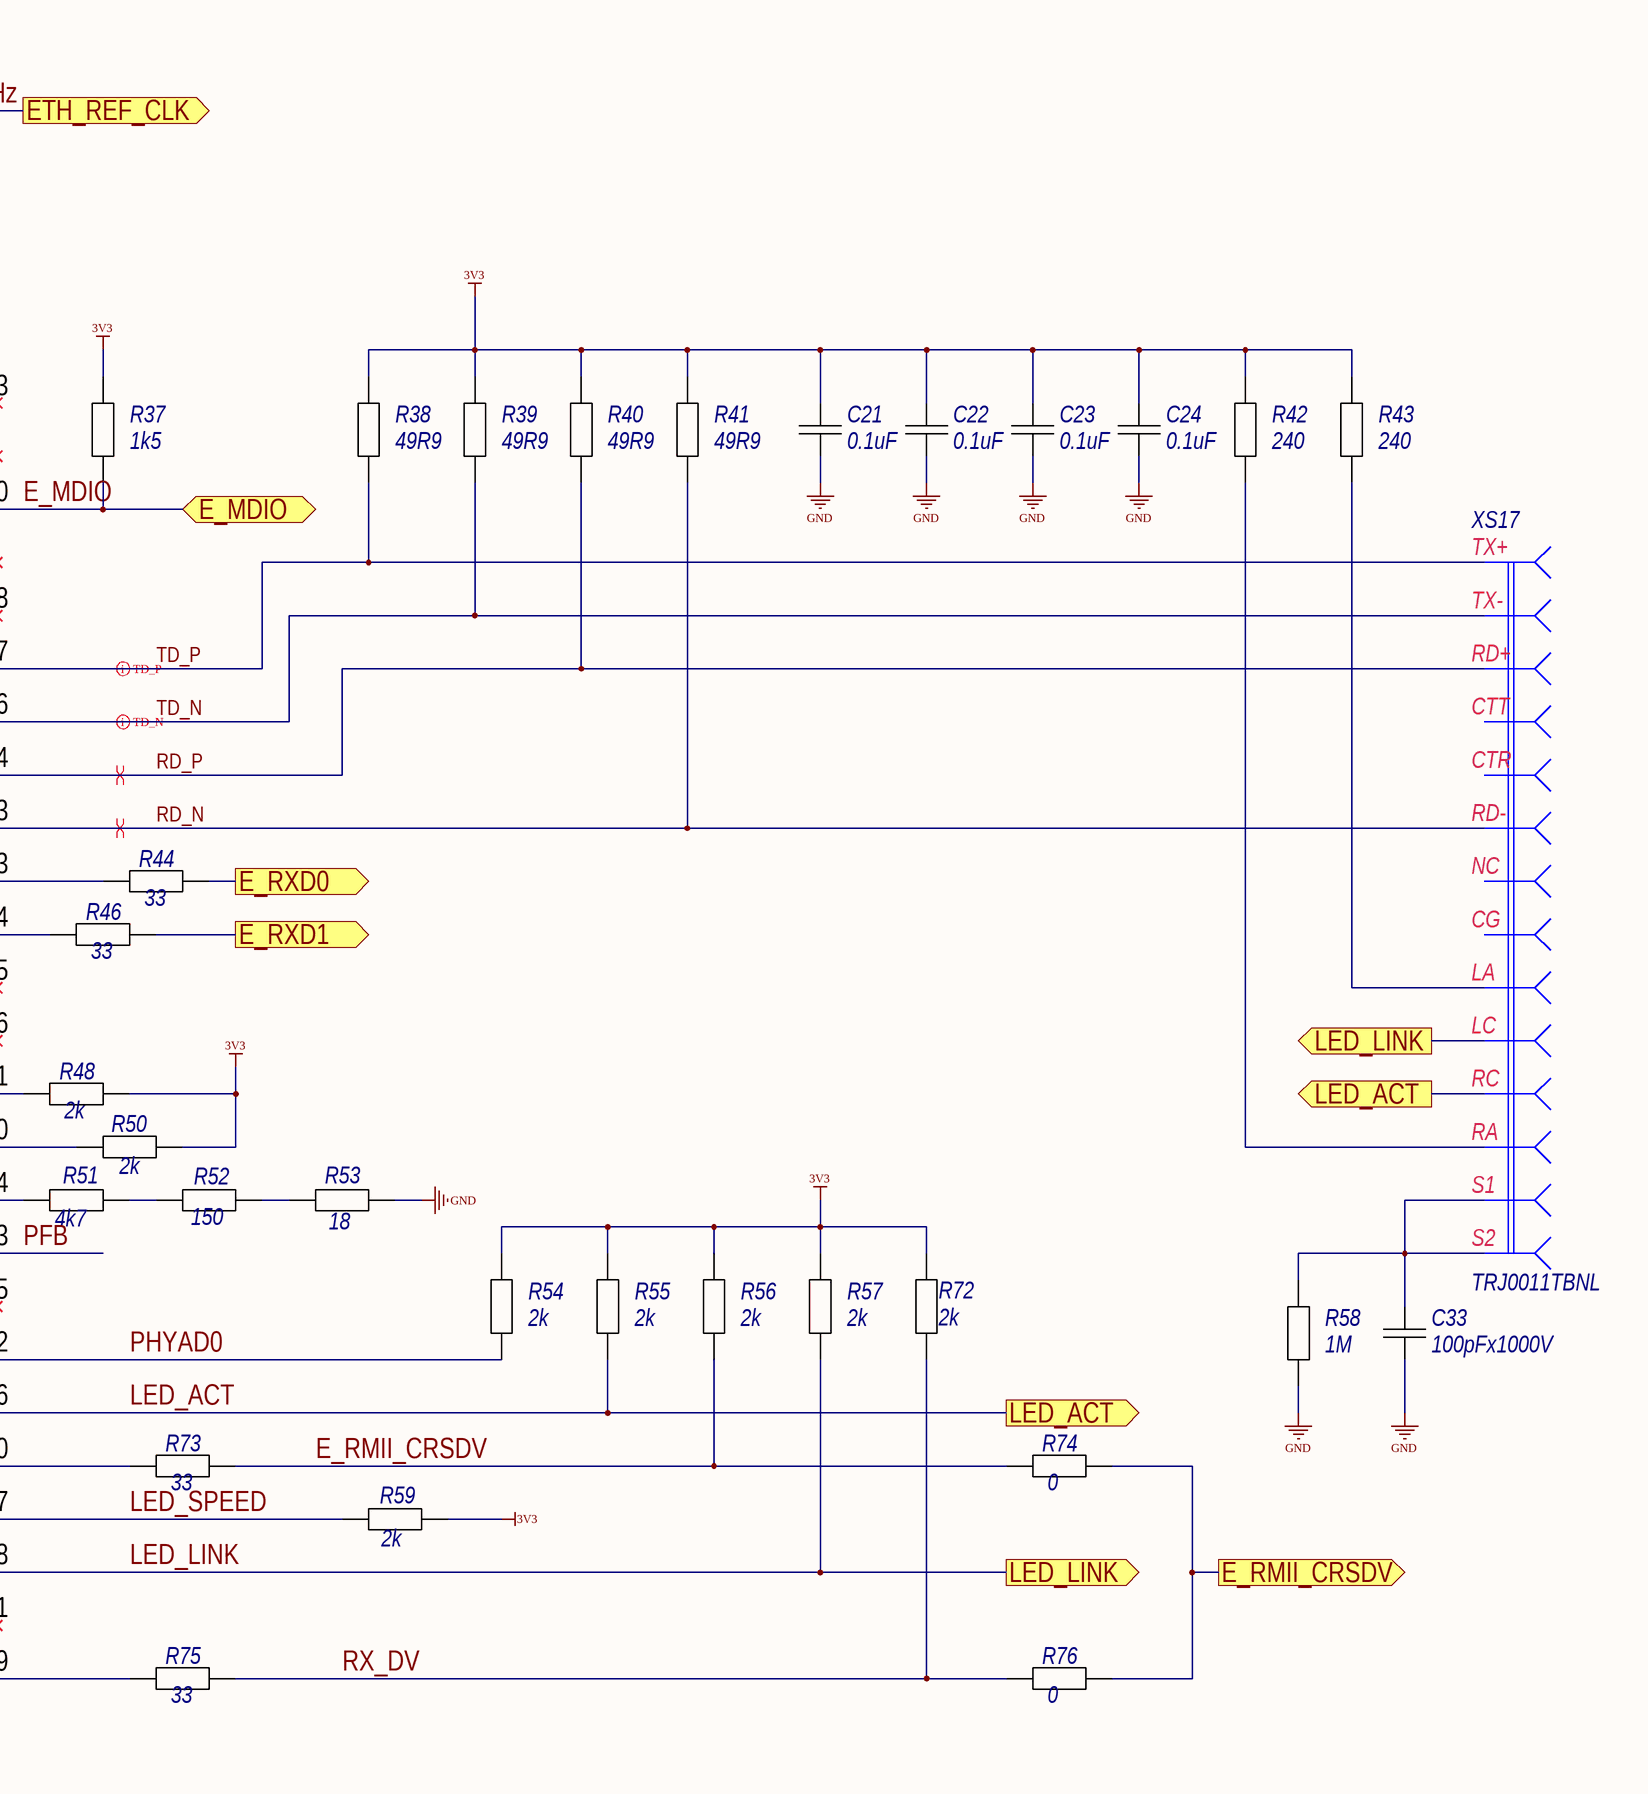
[diagram p9: ETH_PHY.SchDoc, right]

### Parts
C20  15pF  [C0805C]
C21  0.1uF  [C0805C]
C22  0.1uF  [C0805C]
C23  0.1uF  [C0805C]
C24  0.1uF  [C0805C]
C25  0.1uF  [C0805C]
C26  0.1uF  [C0805C]
C27  0.1uF  [C0805C]
C28  0.1uF  [C0805C]
C29  0.1uF  [C0805C]
C30  10uFx10V  [TECAP_A]
C31  0.1uF  [C0805C]
C32  0.1uF  [C0805C]
C33  100pFx1000V  [C0805C]
DA8  CFPS-73  [CFPS-73]
DD4  DP83848CVVNOPB  [QFP48]
R37  1k5  [C0805R]
R38  49R9  [C0805R]
R39  49R9  [C0805R]
R40  49R9  [C0805R]
R41  49R9  [C0805R]
R42  240  [C0805R]
R43  240  [C0805R]
R44  33  [C0805R]
R45  33  [C0805R]
R46  33  [C0805R]
R47  33  [C0805R]
R48  2k  [C0805R]
R49  33  [C0805R]
R50  2k  [C0805R]
R51  4k7  [C0805R]
R52  150  [C0805R]
R53  18  [C0805R]
R54  2k  [C0805R]
R55  2k  [C0805R]
R56  2k  [C0805R]
R57  2k  [C0805R]
R58  1M  [C1210R]
R59  2k  [C0805R]
R60  2k  [C0805R]
R72  2k  [C0805R]
R73  33  [C0805R]
R74  0  [C0805R]
R75  33  [C0805R]
R76  0  [C0805R]
XS17  TRJ0011TBNL  [J0011D018]

### Ports
E_MDC (in), E_MDIO (bidir), E_NRST (in), E_RMII_CRSDV (out), E_RXD0 (out), E_RXD1 (out), E_TXD0 (in), E_TXD1 (in), E_TXEN (in), ETH_REF_CLK (out), LED_ACT (out), LED_LINK (out)

### Nets
3V3: C20.2 C21.2 C22.2 C23.2 C24.2 C25.2 C26.2 C27.2 C28.2 DA8.4(+VS) DD4.22(AVDD33) DD4.32(IOVDD33_2) DD4.48(IOVDD33) R37.2 R38.2 R39.2 R40.2 R41.2 R42.2 R43.2 R48.1 R50.1 R54.2 R55.2 R56.2 R57.2 R59.2 R60.2 R72.2
GND: C20.1 C21.1 C22.1 C23.1 C24.1 C25.1 C26.1 C27.1 C28.1 C29.1 C30.2 C31.2 C32.2 C33.1 DA8.2(GND) DD4.15(AGND_2) DD4.19(AGND) DD4.35(IOGND_2) DD4.36(DGND) DD4.47(IOGND) DD4.49(EPAD) R53.1 R58.1
50MHz: DA8.3(OUT) DD4.34(X1) ; port ETH_REF_CLK
E_MDC: DD4.31(MDC) ; port E_MDC
E_MDIO: DD4.30(MDIO) R37.1 ; port E_MDIO
E_NRST: DD4.29(RESET) ; port E_NRST
E_RMII_CRSDV: R56.1 R73.1 R74.2
E_TXD0: R45.2 ; port E_TXD0
E_TXD1: R47.2 ; port E_TXD1
E_TXEN: R49.2 ; port E_TXEN
LED_ACT: DD4.26(LED_ACT/COL/AN_EN) R55.1 XS17.11 ; port LED_ACT
LED_LINK: DD4.28(LED_LINK/AN0) R57.1 XS17.10 ; port LED_LINK
LED_SPEED: DD4.27(LED_SPEED/AN1) R59.1
PFB: C29.2 C30.1 C31.1 C32.1 DD4.18(PFBIN1) DD4.23(PFBOUT) DD4.37(PFBIN2)
PHYAD0: DD4.42(COL/PHYAD0) R54.1
PWR_DOWN: DD4.7(PWR_DOWN/INT) R60.1
RD_N: DD4.13(RD-) R41.1 XS17.6
RD_P: DD4.14(RD+) R40.1 XS17.3
RX_DV: R72.1 R75.1 R76.2
TD_N: DD4.16(TD-) R39.1 XS17.2
TD_P: DD4.17(TD+) R38.1 XS17.1
NetC33_2: C33.2 R58.2 XS17.S1 XS17.S2
NetDD4_2: DD4.2(TX_EN) R49.1
NetDD4_3: DD4.3(TXD_0) R45.1
NetDD4_4: DD4.4(TXD_1) R47.1
NetDD4_20: DD4.20(RESERVED) R50.2
NetDD4_21: DD4.21(RESERVED_2) R48.2
NetDD4_24: DD4.24(RBIAS) R51.2
NetDD4_39: DD4.39(RX_DV/MII_MODE) R75.2
NetDD4_40: DD4.40(CRS/CRS_DV/LED_CFG) R73.2
NetDD4_43: DD4.43(RXD_0/PHYAD1) R44.2
NetDD4_44: DD4.44(RXD_1/PHYAD2) R46.2
NetDD5_32: R74.1 R76.1 ; port E_RMII_CRSDV
NetDD5_33: R44.1 ; port E_RXD0
NetDD5_34: R46.1 ; port E_RXD1
NetR42_1: R42.1 XS17.12
NetR43_1: R43.1 XS17.9
NetR51_1: R51.1 R52.2
NetR52_1: R52.1 R53.2

Not connected (* = marked no-connect by the designer): DA8 1(STD_OP)*; DD4 1(TX_CLK)* 5(TXD_2)* 6(TXD_3/SNI_MODE)* 8(TCK)* 9(TDO)* 10(TMS)* 11(TRST)* 12(TDI)* 25(25MHZ_OUT)* 33(X2)* 38(RX_CLK)* 41(RX_ER/MDIX_EN)* 45(RXD_2/PHYAD3)* 46(RXD_3/PHYAD4)*; XS17 4 5 7 8

### Layout directives
differential pair; rule Differential Pairs Routing [Pref Gap = 0.254mm    Min Gap  = 0.203mm    Max Gap  = 0.254mmPref Width = 0.381mm    Min Width  = 0.205mm    Max Width  = 0.381mm]: TD_P
differential pair: RD_N, RD_P, TD_N

### Notes on the sheet
- (in symbol CONNECT_RJ45) TX+; TX-; RD+; CTT; CTR; RD-; NC; CG; LA; LC; RC; RA
- (in symbol DP83848) RTX

### Library data of the parts
C20-C29 C31 C32 = CAP_0805: Type: Конденсатор; Published: 18.05.2010; Publisher: Andrew Danich
C30 = CAP_TECAP_A: Type: Конденсатор; Published: 20.08.2010; Publisher: Andrew Danich
C33 = CAP_1206: Type: Конденсатор; Published: 18.05.2010; Publisher: Andrew Danich
DA8 = SPXO018044CFPS-73: IQD FREQUENCY PRODUCTS - SPXO018044-CFPS-73 - OSCILLATOR FREQUENCY, 50MHZ
DD4 = DP83848: ETH Transciever
R37-R57 R59 R60 R72-R76 = RES_0805: Published: 24.03.2010; Publisher: Andrew Danich; Type: Резистор
R58 = RES_1206: Published: 24.03.2010; Publisher: Andrew Danich; Type: Резистор
XS17 = CONNECT_RJ45: Value: Connector; Published: 07.03.2013; Publisher: Andrew Danich; Type: Розетка

## Sheet MCU_CORE.SchDoc
size A2
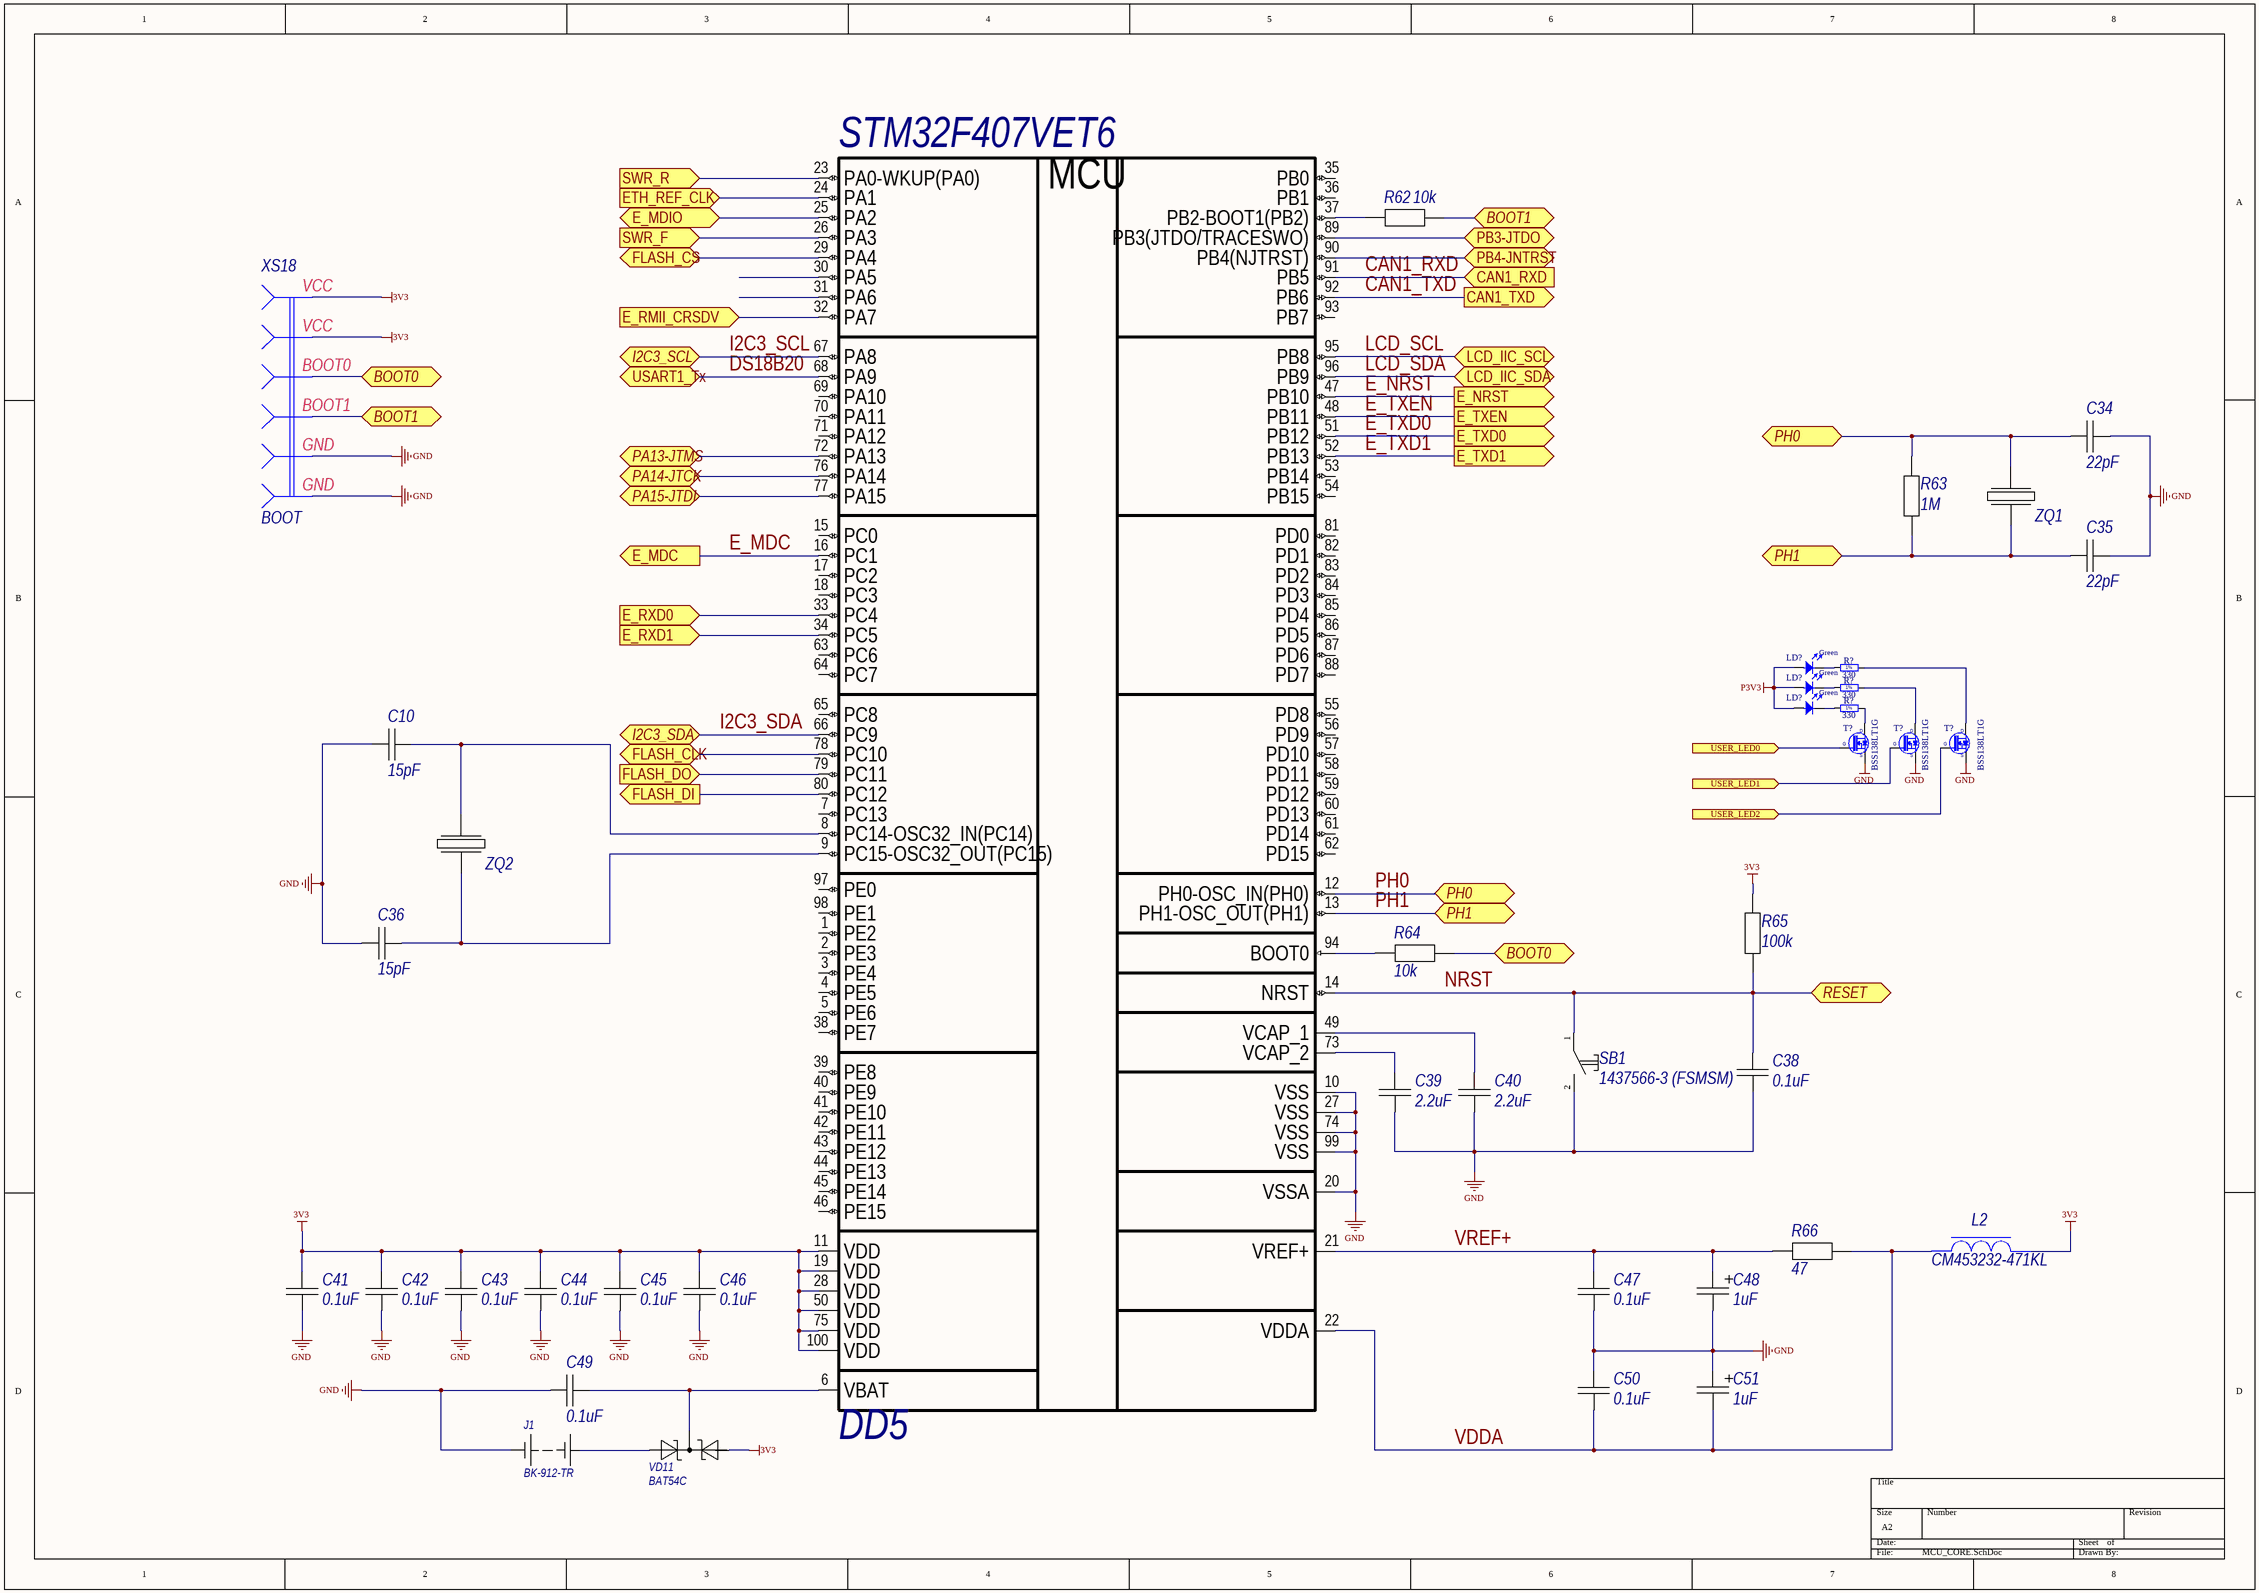
[diagram p10: MCU_CORE.SchDoc]

### Parts
(Parts that share a designator on the sheet are numbered #1, #2 ... from top to bottom, then left to right.)
C10#2  15pF  [C0805C]
C34  22pF  [C0805C]
C35  22pF  [C0805C]
C36  15pF  [C0805C]
C38  0.1uF  [C0805C]
C39  2.2uF  [C0805C]
C40  2.2uF  [C0805C]
C41  0.1uF  [C0805C]
C42  0.1uF  [C0805C]
C43  0.1uF  [C0805C]
C44  0.1uF  [C0805C]
C45  0.1uF  [C0805C]
C46  0.1uF  [C0805C]
C47  0.1uF  [C0805C]
C48  1uF  [TECAP_A]
C49  0.1uF  [C0805C]
C50  0.1uF  [C0805C]
C51  1uF  [TECAP_A]
DD5  STM32F407VET6  [STM-LQFP100_V]
J1  BK-912-TR  [BK-912-TR]
L2  CM453232-471KL  [INDPM4532]
LD?#1  Green  [LED_AVAGO_HSME-C110]
LD?#2  Green  [LED_AVAGO_HSME-C110]
LD?#3  Green  [LED_AVAGO_HSME-C110]
R62  10k  [C0805R]
R63  1M  [C0805R]
R64  10k  [C0805R]
R65  100k  [C0805R]
R66  47  [C0805R]
R?#2  330  [RESC1608X55N]
R?#3  330  [RESC1608X55N]
R?#4  330  [RESC1608X55N]
SB1  1437566-3 (FSMSM)  [1437566-3]
T?#1  BSS138LT1G  [SOT95P240X110-3N]
T?#2  BSS138LT1G  [SOT95P240X110-3N]
T?#3  BSS138LT1G  [SOT95P240X110-3N]
VD11  BAT54C  [BAT54C_SOT23-3]
XS18  BOOT  [PLD2-3]
ZQ1  HC49SM  [HC49SM]  (value not drawn)
ZQ2  FC135  [FC-135]  (value not drawn)

### Ports
BOOT0 (bidir), BOOT1 (bidir), CAN1_RXD (in), CAN1_TXD (out), E_MDC (out), E_MDIO (bidir), E_NRST (out), E_RMII_CRSDV (in), E_RXD0 (in), E_RXD1 (in), E_TXD0 (out), E_TXD1 (out), E_TXEN (out), ETH_REF_CLK (in), FLASH_CLK (bidir), FLASH_CS (bidir), FLASH_DI (out), FLASH_DO (in), I2C3_SCL (bidir), I2C3_SDA (bidir), LCD_IIC_SCL (bidir), LCD_IIC_SDA (bidir), PA13-JTMS (bidir), PA14-JTCK (bidir), PA15-JTDI (bidir), PB3-JTDO (bidir), PB4-JNTRST (bidir), PH0 (bidir), PH1 (bidir), RESET (bidir), SWR_F (in), SWR_R (in), USART1_Tx (bidir), USER_LED0 (in), USER_LED1 (in), USER_LED2 (in)

### Nets
3V3: C41.2 C42.2 C43.2 C44.2 C45.2 C46.2 DD5.11(VDD) DD5.19(VDD) DD5.28(VDD) DD5.50(VDD) DD5.75(VDD) DD5.100(VDD) L2.2 R65.1 VD11.2(C) XS18.1 XS18.2
GND: C10#2.1 C34.1 C35.1 C36.1 C38.1 C39.1 C40.1 C41.1 C42.1 C43.1 C44.1 C45.1 C46.1 C47.1 C48.2 C49.2 C50.2 C51.1 DD5.10(VSS) DD5.20(VSSA) DD5.27(VSS) DD5.74(VSS) DD5.99(VSS) J1.2(-) SB1.2 T?#1.2(S) T?#2.2(S) T?#3.2(S) XS18.5 XS18.6
P3V3: LD?#1.2(A) LD?#2.2(A) LD?#3.2(A)
50MHz: DD5.24(PA1) ; port ETH_REF_CLK
CAN1_RXD: DD5.91(PB5) ; port CAN1_RXD
CAN1_TXD: DD5.92(PB6) ; port CAN1_TXD
DS18B20: DD5.68(PA9) ; port USART1_Tx
E_MDC: DD5.16(PC1) ; port E_MDC
E_MDIO: DD5.25(PA2) ; port E_MDIO
E_NRST: DD5.47(PB10) ; port E_NRST
E_TXD0: DD5.51(PB12) ; port E_TXD0
E_TXD1: DD5.52(PB13) ; port E_TXD1
E_TXEN: DD5.48(PB11) ; port E_TXEN
I2C3_SCL: DD5.67(PA8) ; port I2C3_SCL
I2C3_SDA: DD5.66(PC9) ; port I2C3_SDA
JNTRST: DD5.90(PB4(NJTRST)) ; port PB4-JNTRST
JTCK: DD5.76(PA14) ; port PA14-JTCK
JTDI: DD5.77(PA15) ; port PA15-JTDI
JTDO: DD5.89(PB3(JTDO/TRACESWO)) ; port PB3-JTDO
JTMS: DD5.72(PA13) ; port PA13-JTMS
LCD_SCL: DD5.95(PB8) ; port LCD_IIC_SCL
LCD_SDA: DD5.96(PB9) ; port LCD_IIC_SDA
NRST: C38.2 DD5.14(NRST) R65.2 SB1.1 ; port RESET
PH0: C34.2 DD5.12(PH0-OSC_IN(PH0)) R63.1 ZQ1.2 ; port PH0
PH1: C35.2 DD5.13(PH1-OSC_OUT(PH1)) R63.2 ZQ1.1 ; port PH1
VDDA: C50.1 C51.2 DD5.22(VDDA) L2.1 R66.1
VREF+: C47.2 C48.1 DD5.21(VREF+) R66.2
NetC10#2_2: C10#2.2 DD5.8(PC14-OSC32_IN(PC14)) ZQ2.2
NetC36_2: C36.2 DD5.9(PC15-OSC32_OUT(PC15)) ZQ2.1
NetC39_2: C39.2 DD5.73(VCAP_2)
NetC40_2: C40.2 DD5.49(VCAP_1)
NetC49_1: C49.1 DD5.6(VBAT) VD11.3(AC)
NetDD3_1: DD5.29(PA4) ; port FLASH_CS
NetDD3_2: DD5.79(PC11) ; port FLASH_DO
NetDD3_5: DD5.80(PC12) ; port FLASH_DI
NetDD3_6: DD5.78(PC10) ; port FLASH_CLK
NetDD5_23: DD5.23(PA0-WKUP(PA0)) ; port SWR_R
NetDD5_26: DD5.26(PA3) ; port SWR_F
NetDD5_32: DD5.32(PA7) ; port E_RMII_CRSDV
NetDD5_33: DD5.33(PC4) ; port E_RXD0
NetDD5_34: DD5.34(PC5) ; port E_RXD1
NetDD5_37: DD5.37(PB2-BOOT1(PB2)) R62.2
NetDD5_94: DD5.94(BOOT0) R64.2
NetJ1_1: J1.1(+) VD11.1(А1)
NetLD?#1_1: LD?#1.1(C) R?#2.1
NetLD?#2_1: LD?#2.1(C) R?#3.1
NetLD?#3_1: LD?#3.1(C) R?#4.1
NetR62_1: R62.1 XS18.4 ; port BOOT1
NetR64_1: R64.1 XS18.3 ; port BOOT0
NetR?#2_2: R?#2.2 T?#3.3(D)
NetR?#3_2: R?#3.2 T?#2.3(D)
NetR?#4_2: R?#4.2 T?#1.3(D)
NetT?#1_1: T?#1.1(G) ; port USER_LED0
NetT?#2_1: T?#2.1(G) ; port USER_LED1
NetT?#3_1: T?#3.1(G) ; port USER_LED2

Not connected (* = marked no-connect by the designer): DD5 1(PE2) 2(PE3) 3(PE4) 4(PE5) 5(PE6) 7(PC13) 15(PC0) 17(PC2) 18(PC3) 30(PA5) 31(PA6) 35(PB0) 36(PB1) 38(PE7) 39(PE8) 40(PE9) 41(PE10) 42(PE11) 43(PE12) 44(PE13) 45(PE14) 46(PE15) 53(PB14) 54(PB15) 55(PD8) 56(PD9) 57(PD10) 58(PD11) 59(PD12) 60(PD13) 61(PD14) 62(PD15) 63(PC6) 64(PC7) 65(PC8) 69(PA10) 70(PA11) 71(PA12) 81(PD0) 82(PD1) 83(PD2) 84(PD3) 85(PD4) 86(PD5) 87(PD6) 88(PD7) 93(PB7) 97(PE0) 98(PE1)

### Notes on the sheet
- (in symbol CONNECT_BOOT) VCC; BOOT0; BOOT1; GND
- (in symbol R0603_330R_1%_0.1W_100PPM) 1%
- (in symbol STM32F407VET6) MCU

### Library data of the parts
C10#2 C34-C36 C38-C47 C49 C50 = CAP_0805: Type: Конденсатор; Published: 18.05.2010; Publisher: Andrew Danich
C48 C51 = CAP_TECAP_A: Type: Конденсатор; Published: 20.08.2010; Publisher: Andrew Danich
DD5 = STM32F407VET6: ARM Cortex-M4 32-bit MCU+FPU, 210 DMIPS, 512 kB Flash, 192 kB Internal RAM, 82 I/Os, 100-pin LQFP, -40 to 85 degC, Tray; Manufacturer: STMicroelectronics; D/A Converter: 2x12-bit; FLASH Size (Prog) (kB): 512; I/Os (High Current): 82; Internal RAM Size (kB): 192; Operating Frequency(F) (Processor speed) (MHz): 168; Supply Voltage(Vcc) max (V): 3.6; Supply Voltage(Vcc) min (V): 1.8; DatasheetVersion: Rev. 4; PackageVersion: Rev. 1, 06/2013; PackageReference: LQFP100; PackageDescription: 100-Pin Low Profile Quad Flat Package, 14 x 14 mm Body, 0.5 mm Pitch; Supplier 1: Digi-Key; Supplier Part Number 1: 497-12075-ND; Supplier 2: Farnell; Supplier Part Number 2: 2064367; Supplier 3: Newark; Supplier Part Number 3: 73T2332; Supplier 4: Mouser; Supplier Part Number 4: 511-STM32F407VET6; Core: ARM Cortex-M4; Packing: Tray; Mounting Technology: Surface Mount; PartNumber: STM32F407VET6; ComponentLink1Description: Manufacturer URL; ComponentLink1URL: http://www.st.com/web/en/home.html; ComponentLink2Description: Datasheet; ComponentLink2URL: http://www.st.com/st-web-ui/static/active/en/resource/technical/document/datasheet/DM00037051.pdf; ComponentLink3Description: Package Specification; ComponentLink3URL: http://www.st.com/st-web-ui/static/active/en/resource/technical/document/data_brief/DM00071938.pdf
J1 = BK-912-TR: Holder Coin Cell 20mm Smd
L2 = CM453232-471KL: Type: Дроссель; Published: 20.05.2010; Publisher: Andrew Danich
LD?#1-LD?#3 = LED_AVAGO_HSME-C110: LED Green 1C 2A; Part Description: High Performance Right Angle Chip Green LED; Manufacturer: AVAGO TECHNOLOGIES; PressFit: No; Bonding: No; Part Number: LED_AVAGO_HSME-C110; Component Kind: Standard; Component Type: Standard; Color: Green; PackageDescription: Green Chip LED, 2-Leads, Body 3.3x1.6mm, Side Emitting Package; Manufacturer Part Number: HSME-C110; Pin Count: 2; Mounted: Yes; Socket: No; SMD: Yes; Sense: No; ComponentHeight: 1.1mm; HelpURL: \\cern.ch\dfs\Applications\Altium\Datasheets\LED_AVAGO_HSME-C110.pdf; ComponentLink1URL: \\cern.ch\dfs\Applications\Altium\Datasheets\LED_AVAGO_HSME-C110_DESIGN-GUIDE.pdf; ComponentLink1Description: Design Guide; Author: CERN DEM JMW; CreateDate: 30.07.2009; LatestRevisionDate: 20.06.2012
R62-R66 = RES_0805: Published: 24.03.2010; Publisher: Andrew Danich; Type: Резистор
R?#2-R?#4 = R0603_330R_1%_0.1W_100PPM: Resistor - 1%; Part Description: General Purpose Thick Film Chip Resistor; Manufacturer: GENERIC; Manufacturer1 Part Number: NRC06F3300TRF; Power: 0.1W; TC: ±100ppm/°C; PressFit: No; Part Number: R0603_330R_1%_0.1W_100PPM; Component Kind: Standard; Component Type: Standard; Pin Count: 2; Value: 330; Status: Preferred; Tolerance: ±1%; Manufacturer Part Number: R0603_330R_1%_0.1W_100PPM; Case: 0603; Mounted: Yes; Socket: No; SMD: Yes; Manufacturer1 Example: NIC COMPONENT; Manufacturer1 ComponentHeight: 0.55mm; HelpURL: \\cern.ch\dfs\Applications\Altium\Datasheets\R0603_NIC_NRC.pdf; Author: CERN DEM JLC; CreateDate: 03-Dec-07; LatestRevisionDate: 13-Mar-08; Sense: No
SB1 = BT-01x-01p: Published: 17.04.2014; Publisher: Andrew Danich; Type: Переключатель
T?#1-T?#3 = BSS138LT1G: N-CHANNEL MOSFET WITH DIODE; Part Description: 50V 200mA N-Channel Enhancement Mode Field-Effect Transistor; Manufacturer: ON SEMICONDUCTOR; PressFit: No; Bonding: No; Part Number: BSS138LT1G; Component Kind: Standard; Component Type: Standard; Device: BSS138LT1G; PackageDescription: SOT23 3-Leads, Pitch 0.95mm - Body 1.4x3mm, IPC Medium Density; Manufacturer Part Number: BSS138LT1G; Pin Count: 3; Case: SOT23-3; Mounted: Yes; Socket: No; SMD: Yes; Sense: No; ComponentHeight: 1.11mm; HelpURL: \\cern.ch\dfs\Applications\Altium\Datasheets\BSS138LT1G.pdf; Author: CERN DEM JLC; CreateDate: 23-Mar-09; LatestRevisionDate: 23-Mar-09
VD11 = BAT54C: as VD2 on sheet DIRECTIONAL_COUPLER
XS18 = CONNECT_BOOT: Value: Connector; Published: 07.03.2013; Publisher: Andrew Danich; Type: Розетка
ZQ1 = HC49SM: Published: 08.03.2013; Publisher: Andrew Danich; Type: Резонатор
ZQ2 = FC135: Published: 08.03.2013; Publisher: Andrew Danich; Type: Резонатор

## Sheet IIC_LCD.SchDoc
size A3
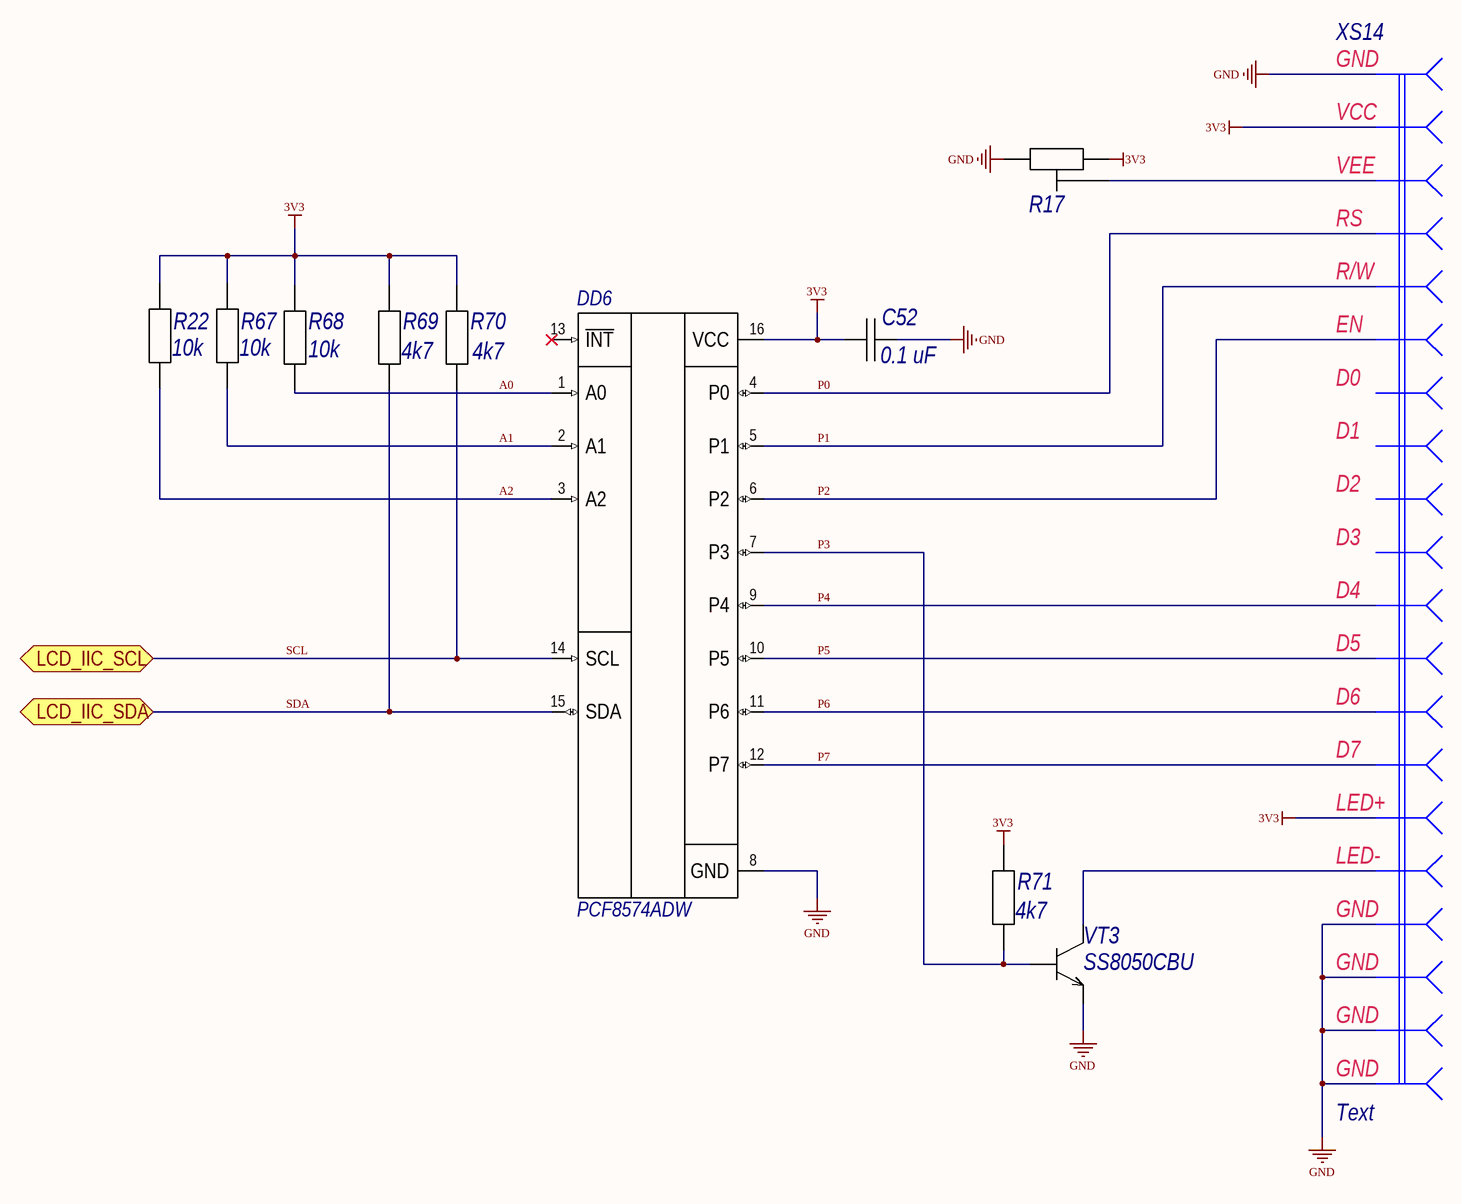
[diagram p11: IIC_LCD.SchDoc]

### Parts
C52  0.1 uF  [C0805C]
DD6  PCF8574ADW  [SOIC127P1030X265-16N]
R17  RES_VAR  [TRIM_3296W-1-254LF]  (value not drawn)
R22  10k  [C0805R]
R67  10k  [C0805R]
R68  10k  [C0805R]
R69  4k7  [C0805R]
R70  4k7  [C0805R]
R71  4k7  [C0805R]
VT3  SS8050CBU  [TO-92-A]
XS14  Text  [IDC-20]

### Ports
LCD_IIC_SCL (bidir), LCD_IIC_SDA (bidir)

### Nets
3V3: C52.2 DD6.16(VCC) R17.1 R22.2 R67.2 R68.2 R69.2 R70.2 R71.2 XS14.2 XS14.15
GND: C52.1 DD6.8(GND) R17.3 VT3.3(Э) XS14.1 XS14.17 XS14.18 XS14.19 XS14.20
A0: DD6.1(A0) R68.1
A1: DD6.2(A1) R67.1
A2: DD6.3(A2) R22.1
P0: DD6.4(P0) XS14.4
P1: DD6.5(P1) XS14.5
P2: DD6.6(P2) XS14.6
P3: DD6.7(P3) R71.1 VT3.1(Б)
P4: DD6.9(P4) XS14.11
P5: DD6.10(P5) XS14.12
P6: DD6.11(P6) XS14.13
P7: DD6.12(P7) XS14.14
SCL: DD6.14(SCL) R70.1 ; port LCD_IIC_SCL  [project net LCD_SCL]
SDA: DD6.15(SDA) R69.1 ; port LCD_IIC_SDA  [project net LCD_SDA]
NetR17_2: R17.2 XS14.3
NetVT3_2: VT3.2(К) XS14.16

Not connected (* = marked no-connect by the designer): DD6 13(~{INT})*; XS14 7 8 9 10

### Notes on the sheet
- (in symbol CONNECT_LCD) GND; VCC; VEE; RS; R/W; EN; D0; D1; D2; D3; D4; D5; D6; D7; LED+; LED-

### Library data of the parts
C52 = CAP_0805: Type: Конденсатор; Published: 18.05.2010; Publisher: Andrew Danich
DD6 = PCF8574ADW: Remote 8-Bit I/O Expander for I2C-Bus 16-SOIC -40 to 85; MF: Texas Instruments; Mouser-Purchase-URL: https://snapeda.com/shop?store=Mouser&id=554599; SnapEDA_Link: https://www.snapeda.com/parts/PCF8574ADW/Texas%20Instruments/view-part/554599/?ref=snap; DigiKey-Purchase-URL: https://snapeda.com/shop?store=DigiKey&id=554599; Package: SOIC-16 Texas Instruments; MP: PCF8574ADW; Price: None; Availability: Warning; Texas_Instruments-Purchase-URL: https://snapeda.com/shop?store=Texas+Instruments&id=554599; Value: *
R22 R67-R71 = RES_0805: Published: 24.03.2010; Publisher: Andrew Danich; Type: Резистор
VT3 = SS8050CBU: Type: Транзистор; Published: 07.05.2013; Publisher: Andrew Danich
XS14 = CONNECT_LCD: Value: Connector; Published: 07.03.2013; Publisher: Andrew Danich; Type: Розетка
R17 = RES_VAR: Publisher: Andrew Danich; Type: Подстроечный резистор; Published: 27.07.2015

## Sheet EEPROM.SchDoc
size A3
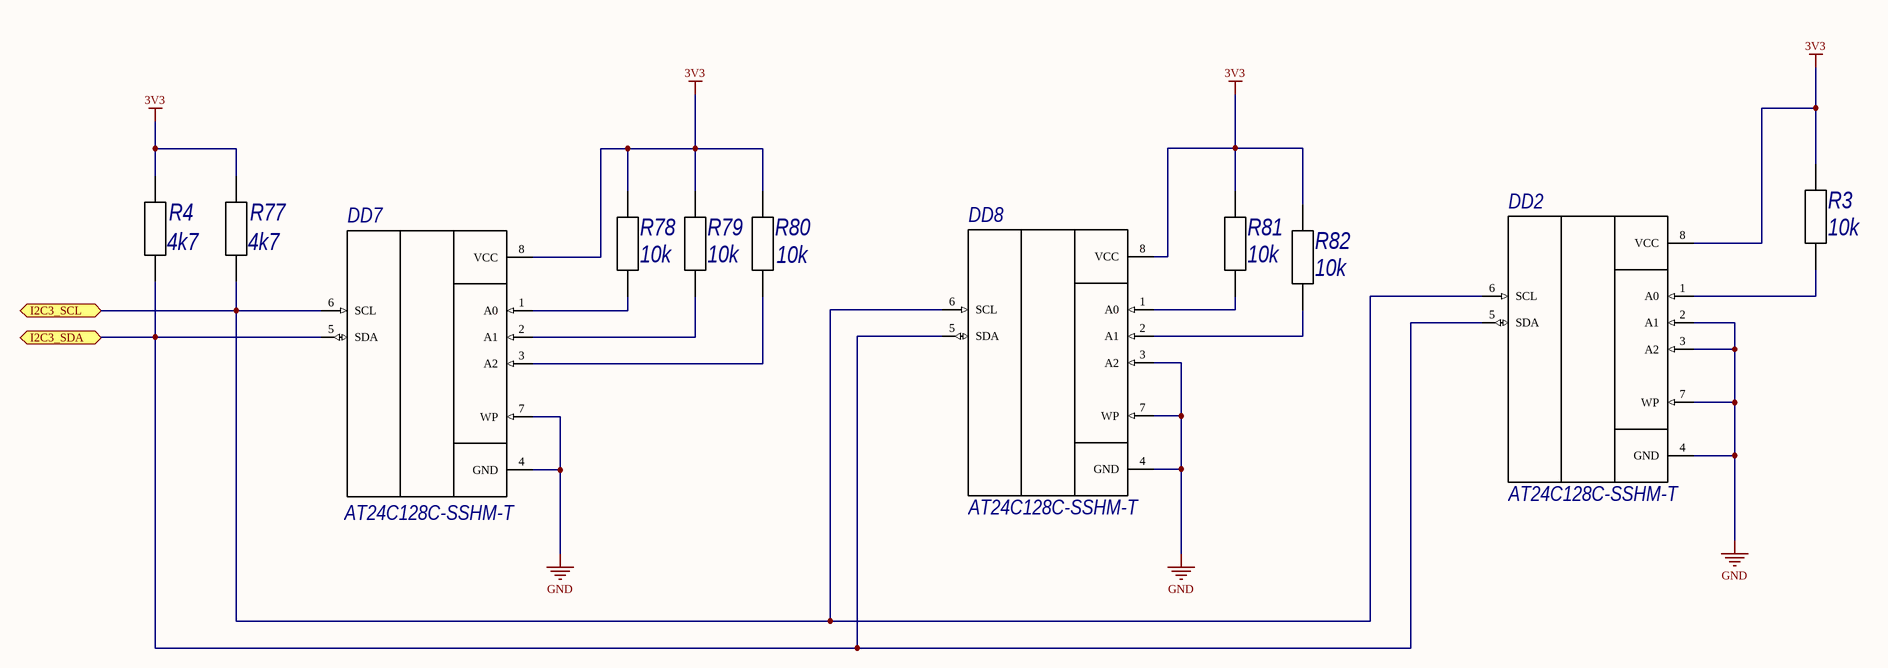
[diagram p12: EEPROM.SchDoc]

### Parts
(Parts that share a designator on the sheet are numbered #1, #2 ... from top to bottom, then left to right.)
DD2#2  AT24C128C-SSHM-T  [SOIC127P600X175-8N]
DD7  AT24C128C-SSHM-T  [SOIC127P600X175-8N]
DD8  AT24C128C-SSHM-T  [SOIC127P600X175-8N]
R3#2  10k  [C0805R]
R4#2  4k7  [C0805R]
R77  4k7  [C0805R]
R78  10k  [C0805R]
R79  10k  [C0805R]
R80  10k  [C0805R]
R81  10k  [C0805R]
R82  10k  [C0805R]

### Ports
I2C3_SCL (bidir), I2C3_SDA (bidir)

### Nets
3V3: DD2#2.8(VCC) DD7.8(VCC) DD8.8(VCC) R3#2.2 R4#2.2 R77.2 R78.2 R79.2 R80.2 R81.2 R82.2
GND: DD2#2.2(A1) DD2#2.3(A2) DD2#2.4(GND) DD2#2.7(WP) DD7.4(GND) DD7.7(WP) DD8.3(A2) DD8.4(GND) DD8.7(WP)
I2C3_SCL: DD2#2.6(SCL) DD7.6(SCL) DD8.6(SCL) R77.1 ; port I2C3_SCL
I2C3_SDA: DD2#2.5(SDA) DD7.5(SDA) DD8.5(SDA) R4#2.1 ; port I2C3_SDA
NetDD2#2_1: DD2#2.1(A0) R3#2.1
NetDD7_1: DD7.1(A0) R78.1
NetDD7_2: DD7.2(A1) R79.1
NetDD7_3: DD7.3(A2) R80.1
NetDD8_1: DD8.1(A0) R81.1
NetDD8_2: DD8.2(A1) R82.1

### Library data of the parts
DD2#2 DD7 DD8 = AT24C128C-SSHM-T: as U#1 on sheet FLASH; MP: AT24C128C-SSHM-T; SnapEDA_Link: https://www.snapeda.com/parts/AT24C128C-SSHM-T/Microchip/view-part/1771999/?ref=snap; Value: *; Package: SO-8 Microchip; Price: None; Availability: Unavailable
R3#2 R4#2 R77-R82 = RES_0805: Published: 24.03.2010; Publisher: Andrew Danich; Type: Резистор

## Nets that join several sheets
3V3: POWER_SUPPLY (6 pins), CAN (C9.2 C10#1.2 DD1.3 DD2#1.3), FLASH (5 pins), DS18B20 (5 pins), DIRECTIONAL_COUPLER (VD2.3), JTAG_MCU (6 pins), ETH_PHY (29 pins), MCU_CORE (17 pins), IIC_LCD (11 pins), EEPROM (11 pins)
+12V: POWER_SUPPLY (5 pins), FAN_CTRL (R18.2 R19.2 XS11.2 XS12.2), SEQUENCER (6 pins)
GND: POWER_SUPPLY (11 pins), CAN (8 pins), FLASH (C11.1 DD3.4), DS18B20 (XS6.3 XS7.3 XS8.3 XS9.3), DIRECTIONAL_COUPLER (9 pins), FAN_CTRL (VD4.1 VD5.1 XS11.1 XS12.1), JTAG_MCU (10 pins), SEQUENCER (13 pins), ETH_PHY (23 pins), MCU_CORE (30 pins), IIC_LCD (9 pins), EEPROM (9 pins)
50MHz: ETH_PHY (DA8.3 DD4.34), MCU_CORE (DD5.24)
CAN1_RXD: CAN (DD1.4), MCU_CORE (DD5.91)
CAN1_TXD: CAN (DD1.1), MCU_CORE (DD5.92)
E_MDC: ETH_PHY (DD4.31), MCU_CORE (DD5.16)
E_MDIO: ETH_PHY (DD4.30 R37.1), MCU_CORE (DD5.25)
E_NRST: ETH_PHY (DD4.29), MCU_CORE (DD5.47)
E_TXD0: ETH_PHY (R45.2), MCU_CORE (DD5.51)
E_TXD1: ETH_PHY (R47.2), MCU_CORE (DD5.52)
E_TXEN: ETH_PHY (R49.2), MCU_CORE (DD5.48)
I2C3_SCL: MCU_CORE (DD5.67), EEPROM (DD2#2.6 DD7.6 DD8.6 R77.1)
I2C3_SDA: MCU_CORE (DD5.66), EEPROM (DD2#2.5 DD7.5 DD8.5 R4#2.1)
JNTRST: JTAG_MCU (R23.1 XS15.3), MCU_CORE (DD5.90)
JTCK: JTAG_MCU (R27.2 XS15.9), MCU_CORE (DD5.76)
JTDI: JTAG_MCU (R24.1 XS15.5), MCU_CORE (DD5.77)
JTDO: JTAG_MCU (R26.1 XS15.13), MCU_CORE (DD5.89)
JTMS: JTAG_MCU (R25.1 XS15.7), MCU_CORE (DD5.72)
LCD_SCL: MCU_CORE (DD5.95), IIC_LCD (DD6.14 R70.1)
LCD_SDA: MCU_CORE (DD5.96), IIC_LCD (DD6.15 R69.1)
NetDD3_1: FLASH (DD3.1 R5.1), MCU_CORE (DD5.29)
NetDD3_2: FLASH (DD3.2), MCU_CORE (DD5.79)
NetDD3_5: FLASH (DD3.5), MCU_CORE (DD5.80)
NetDD3_6: FLASH (DD3.6), MCU_CORE (DD5.78)
NetDD5_23: DIRECTIONAL_COUPLER (R8.1 VD2.1), MCU_CORE (DD5.23)
NetDD5_26: DIRECTIONAL_COUPLER (R13.1 VD2.2), MCU_CORE (DD5.26)
NetDD5_32: ETH_PHY (R74.1 R76.1), MCU_CORE (DD5.32)
NetDD5_33: ETH_PHY (R44.1), MCU_CORE (DD5.33)
NetDD5_34: ETH_PHY (R46.1), MCU_CORE (DD5.34)
NRST: JTAG_MCU (XS15.15), MCU_CORE (C38.2 DD5.14 R65.2 SB1.1)